# EAGLE board Accumulator Control Unit rev1 (EAGLE 9.6.2)
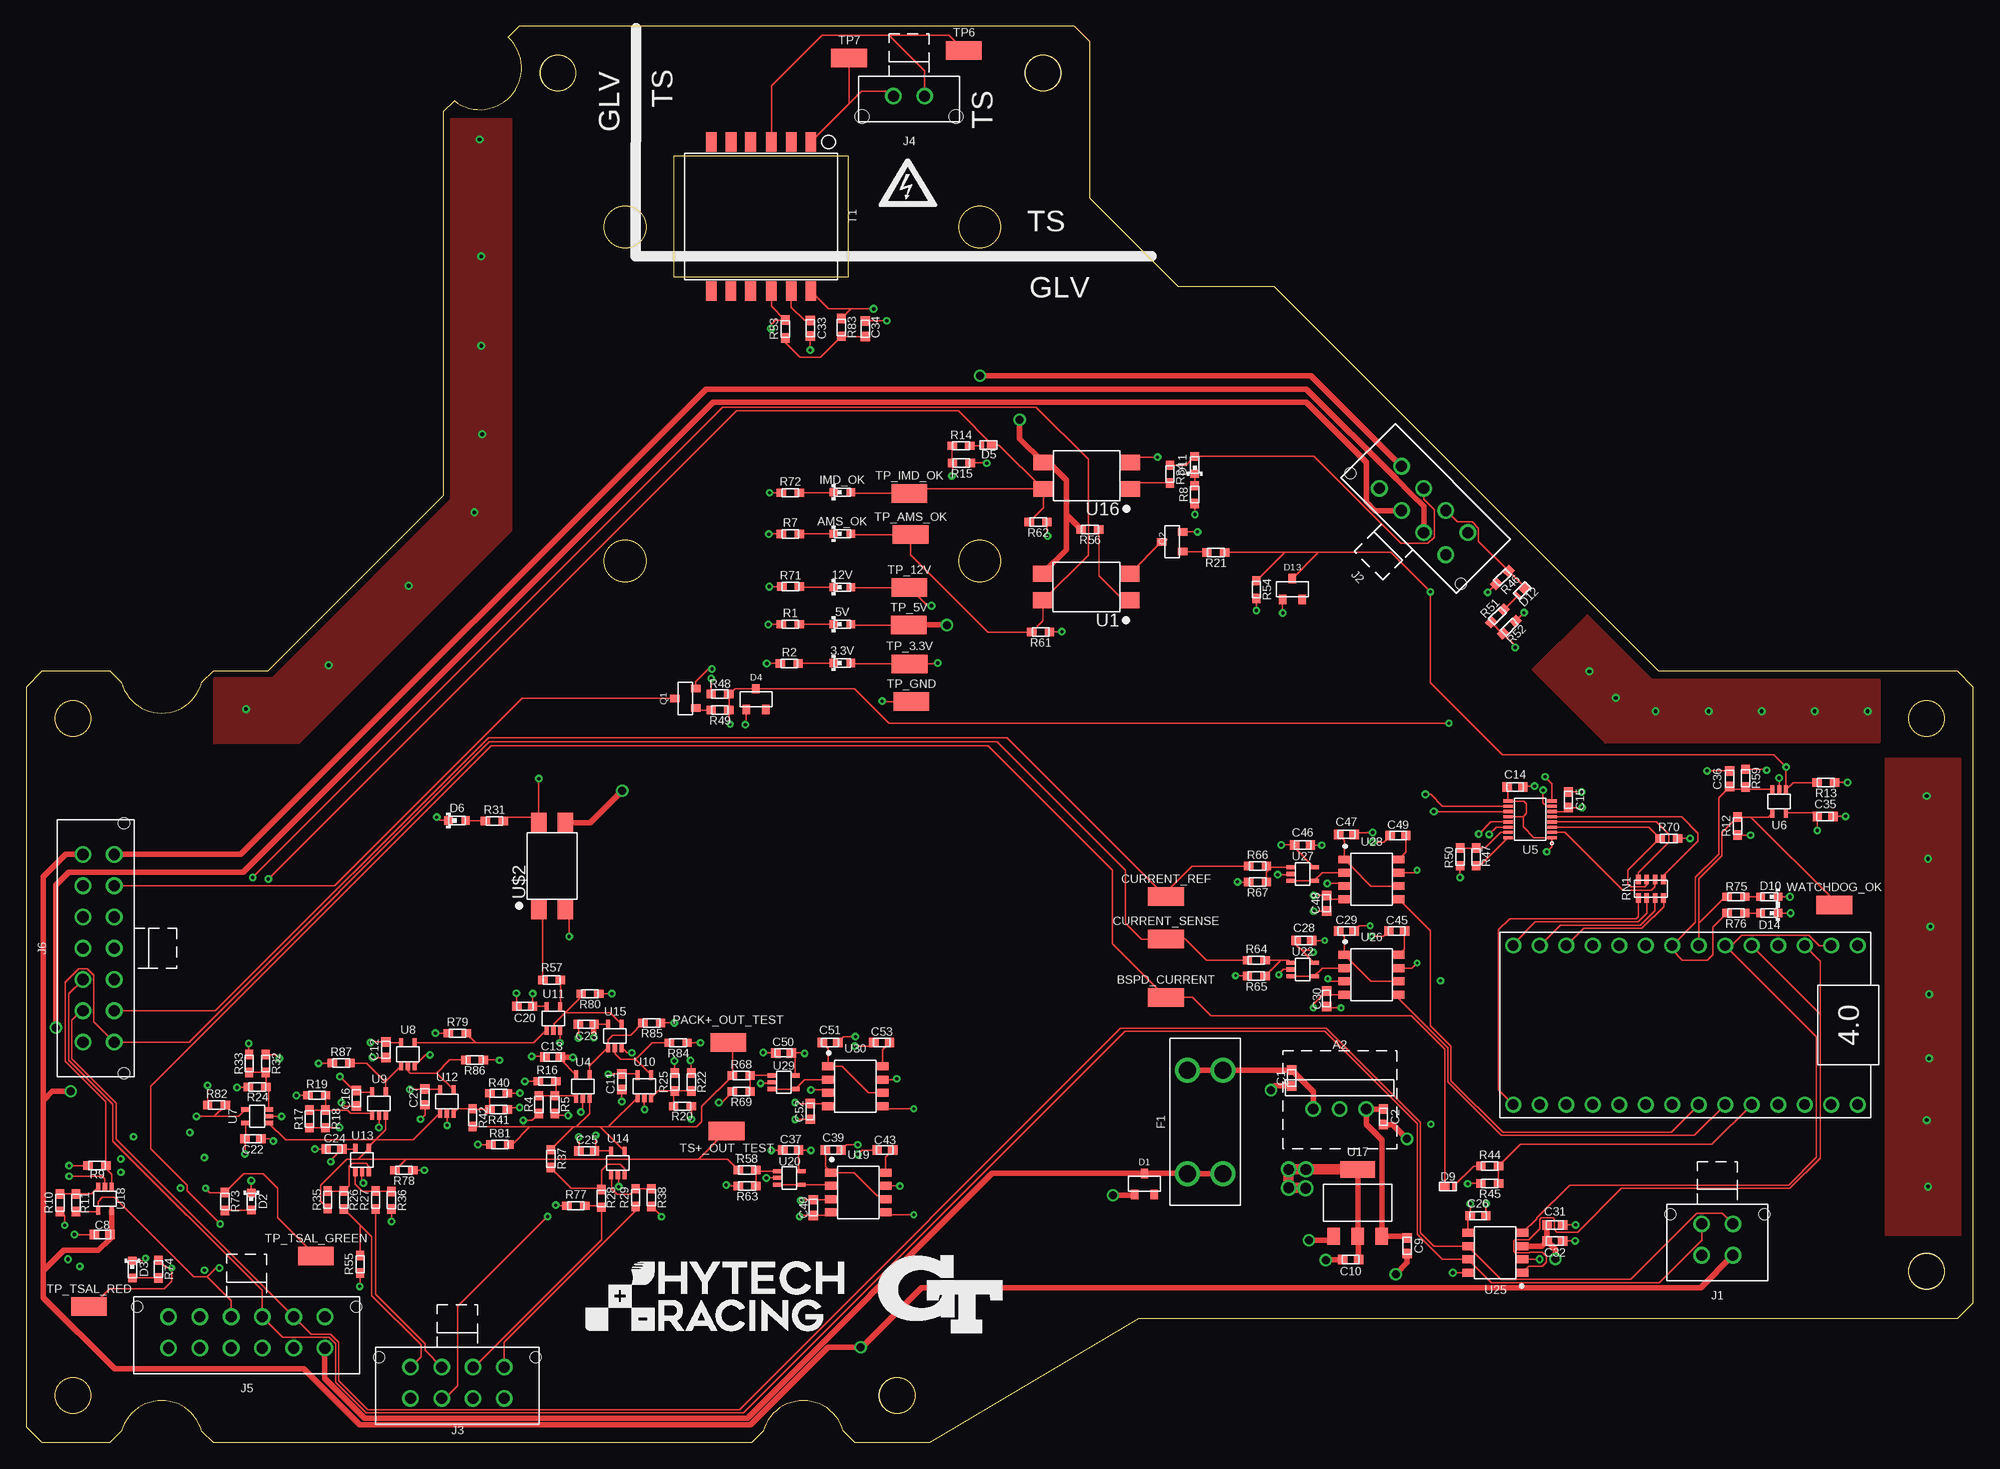
[diagram p5: board, top side]
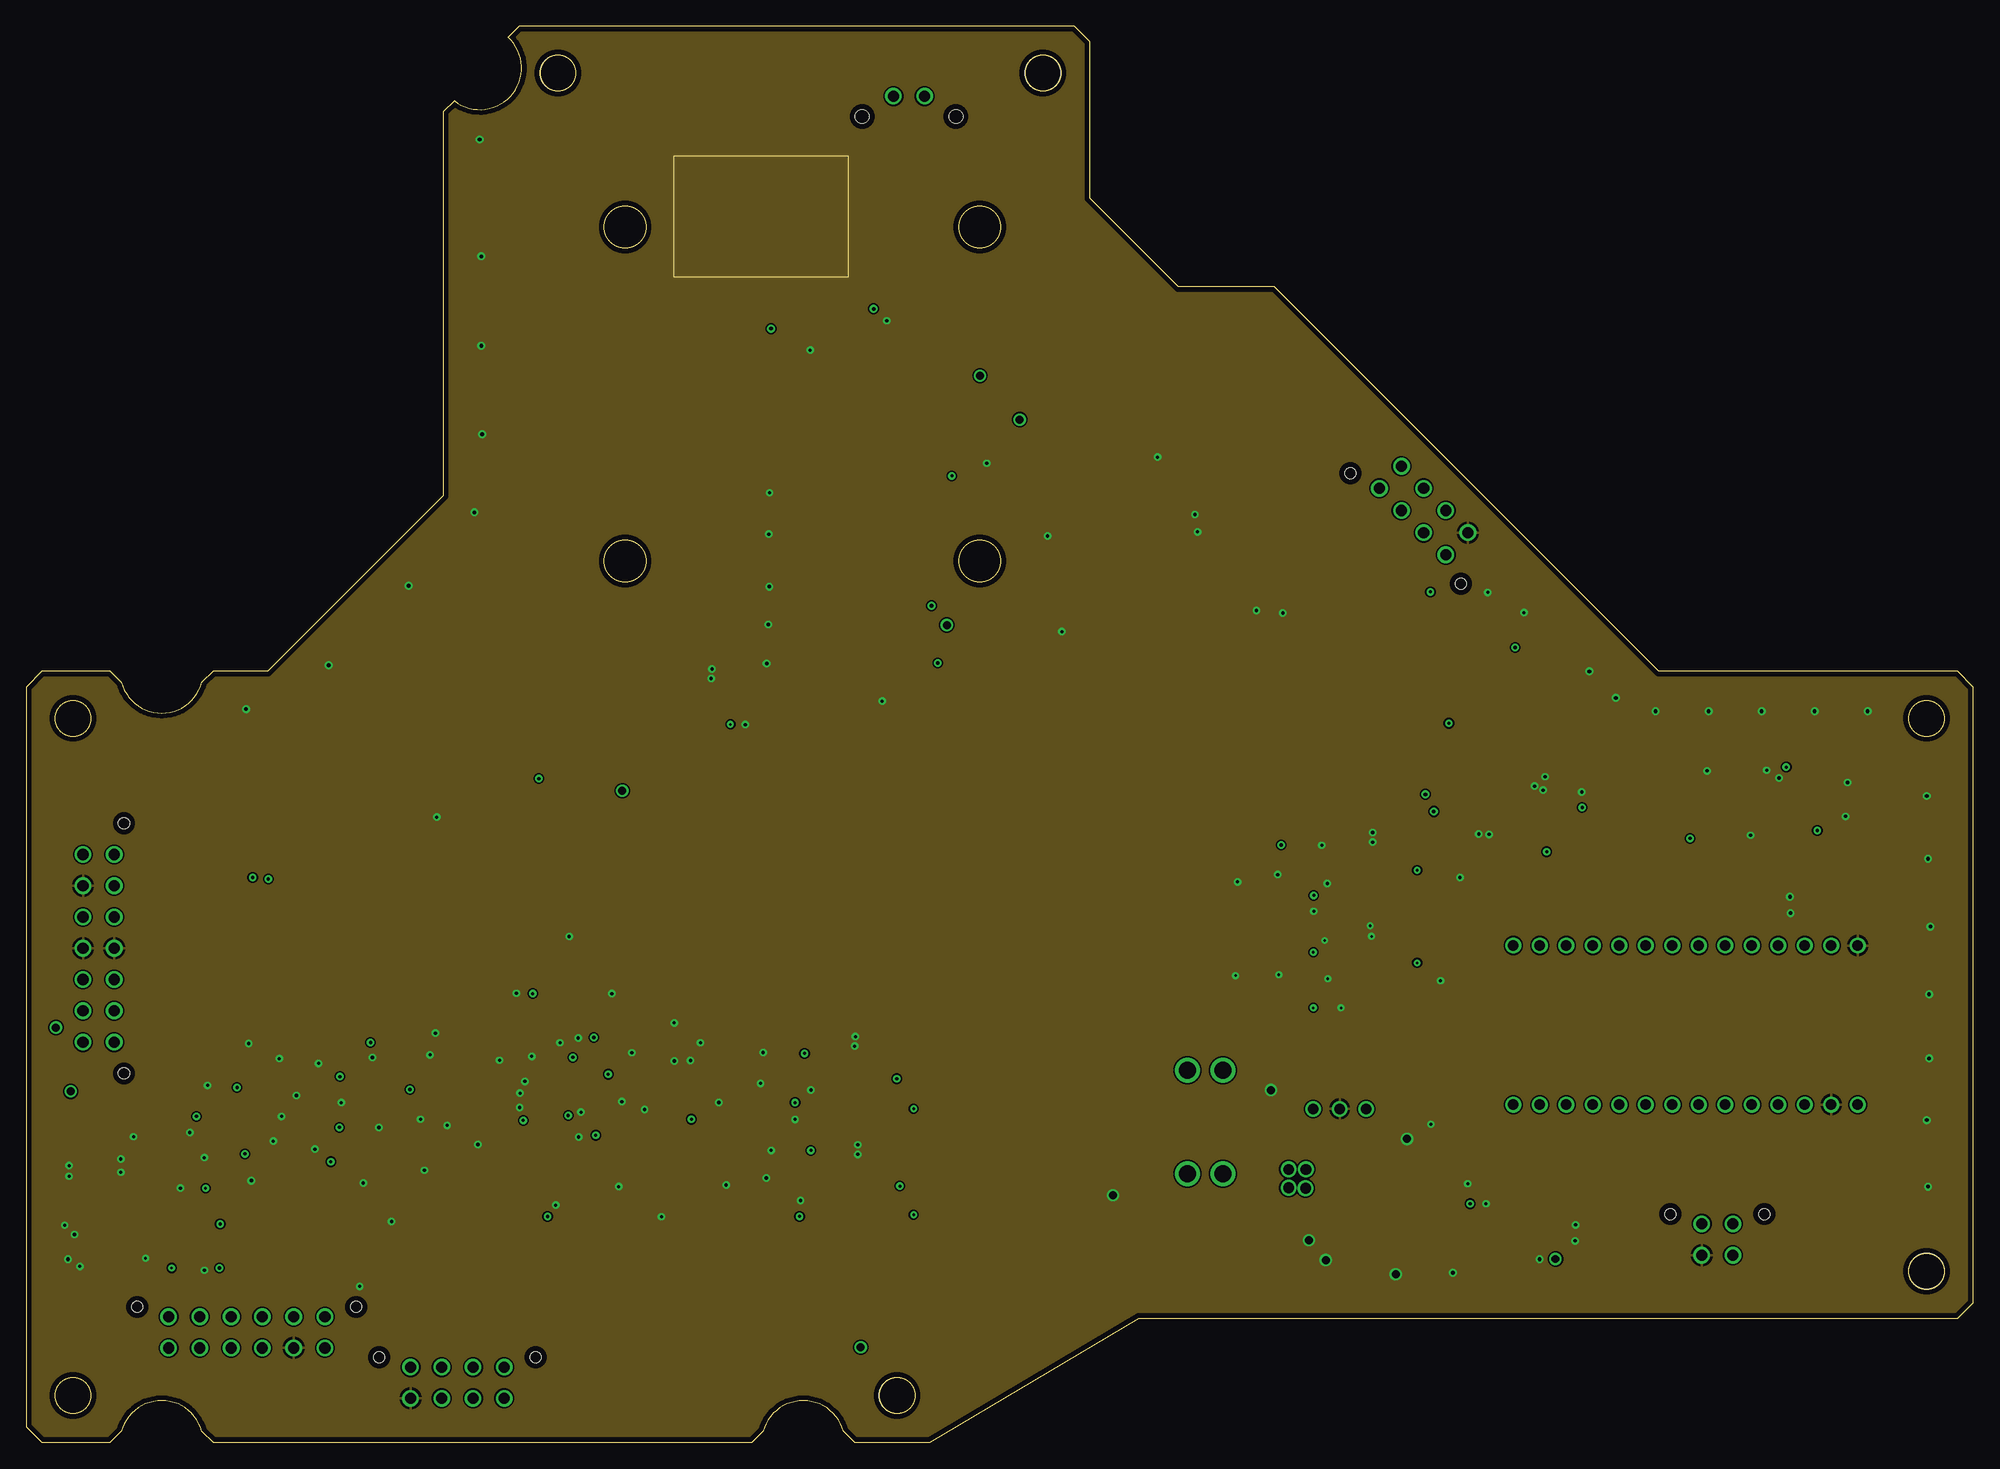
[diagram p6: board, inner layer GND]
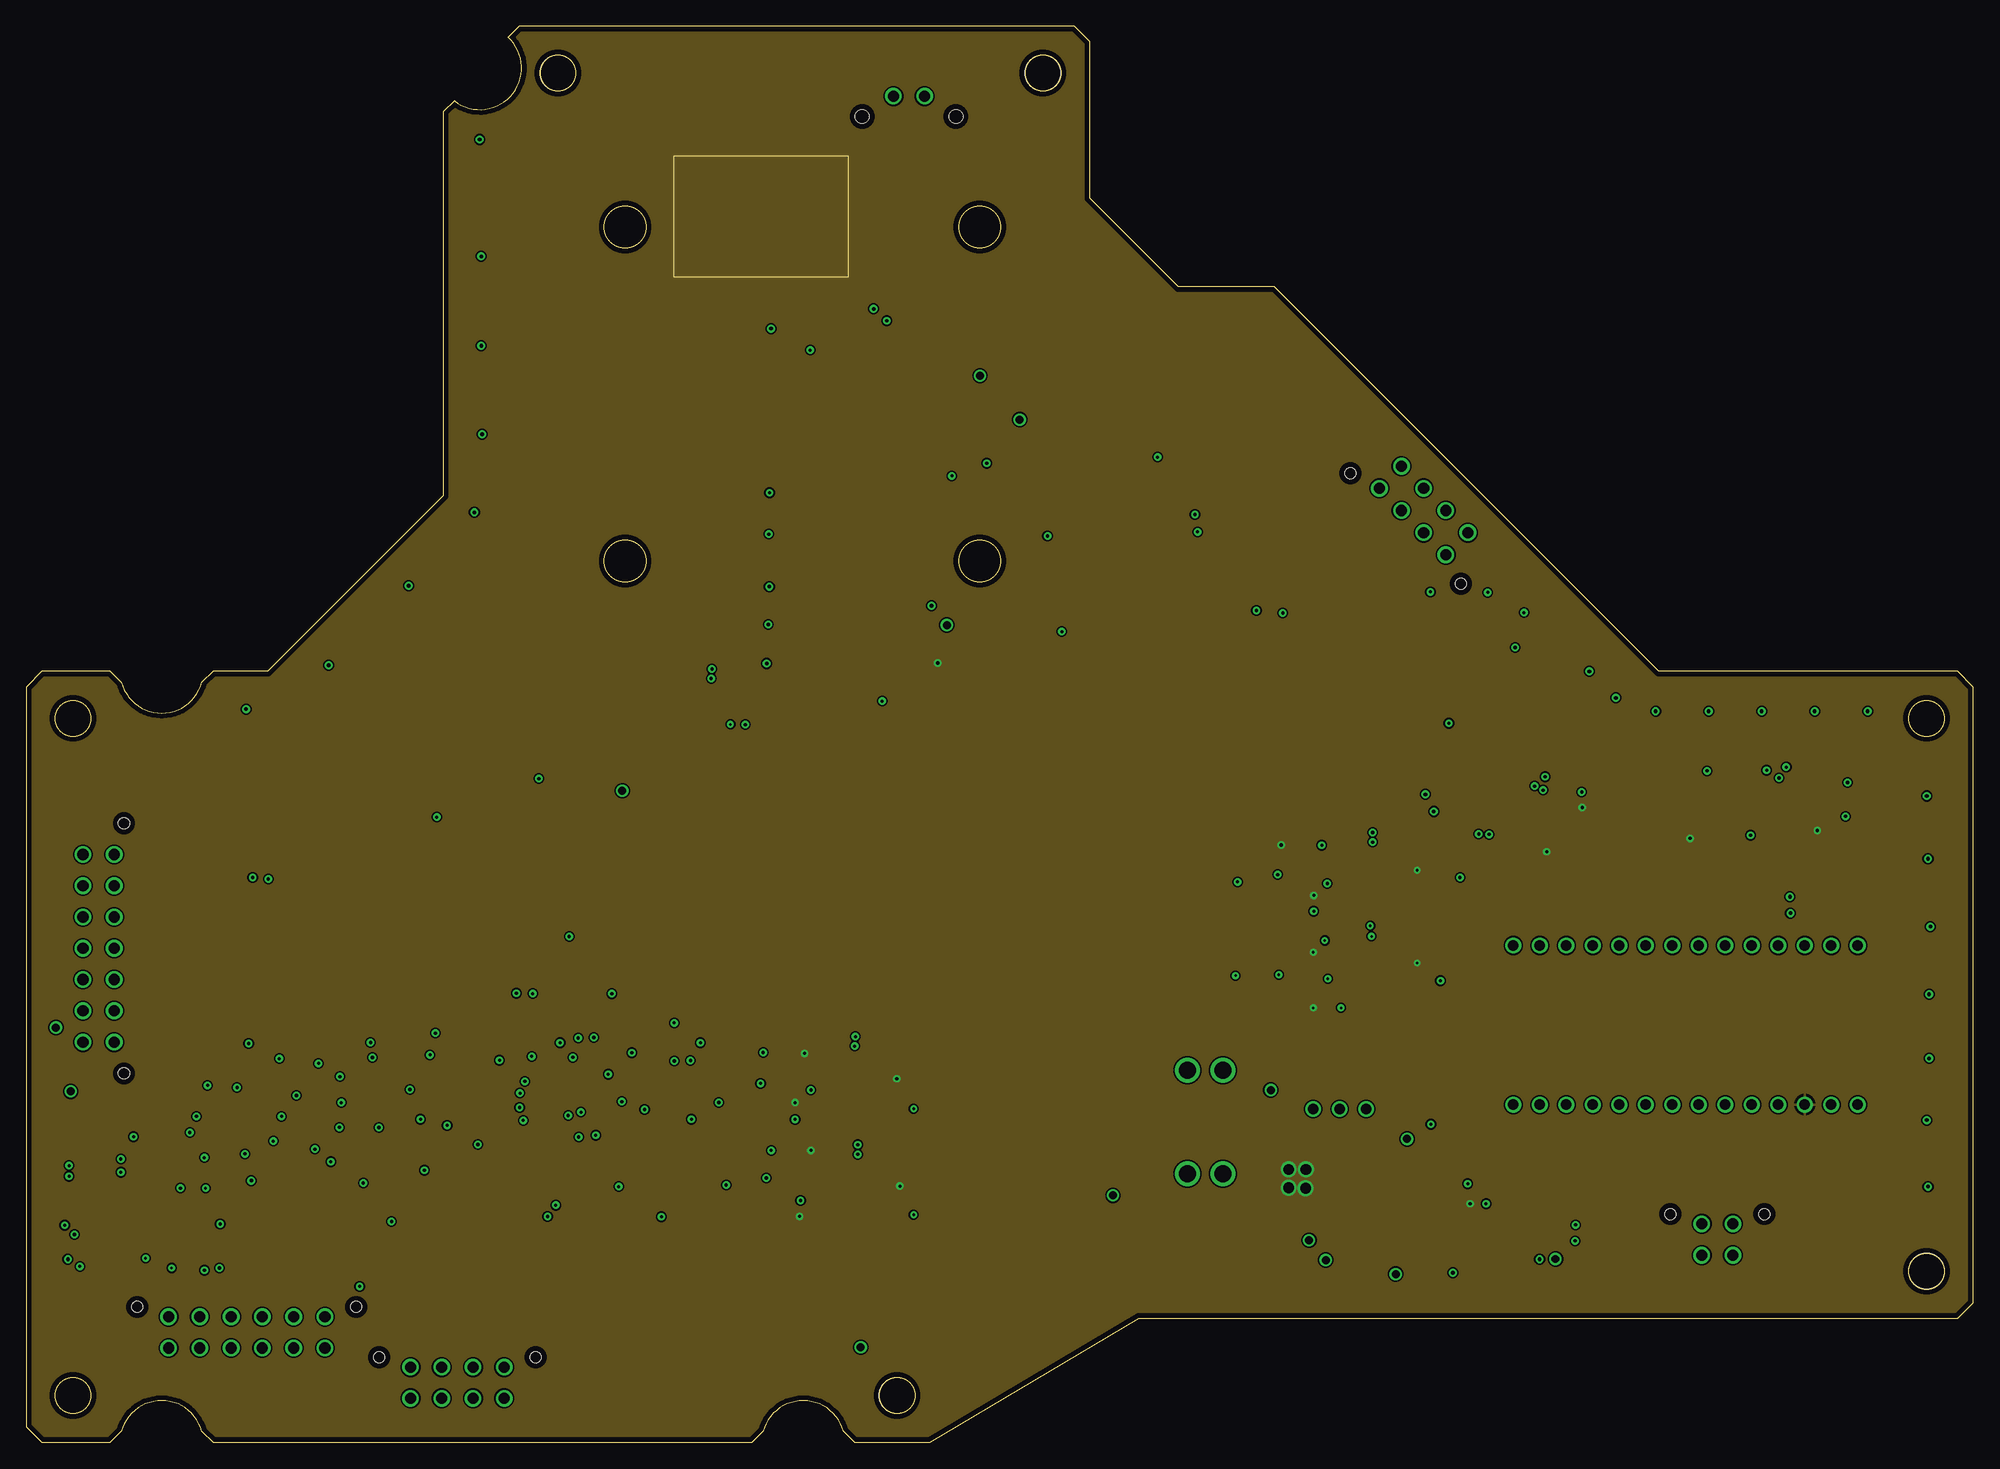
[diagram p7: board, inner layer +3V3]
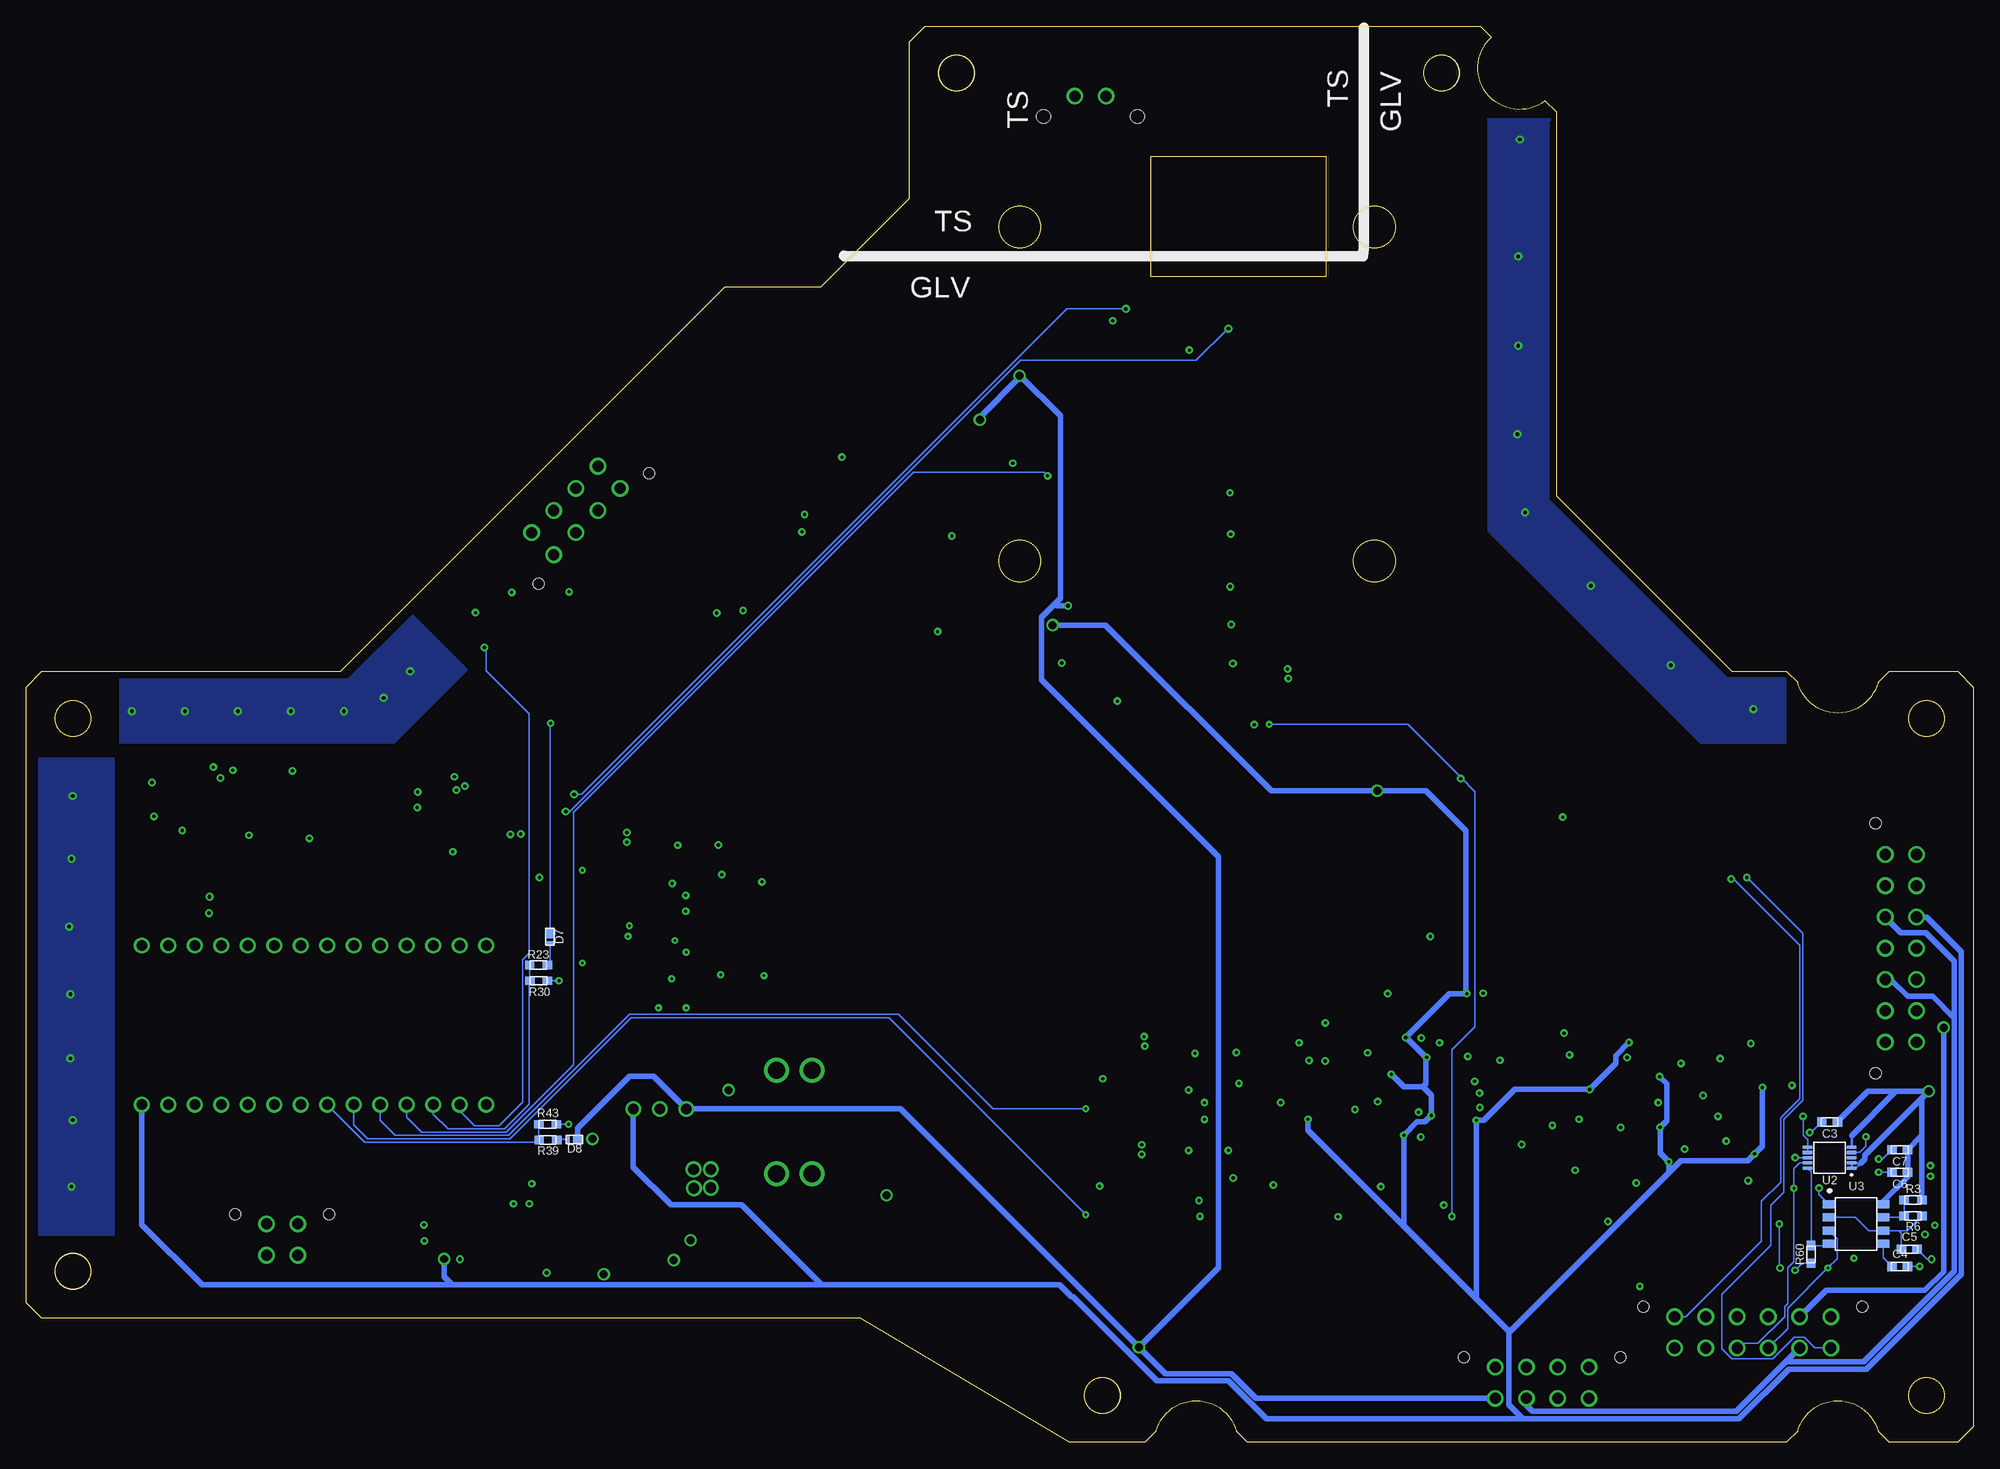
[diagram p8: board, bottom side, seen from below]

Size 186.67 x 135.74 mm. Coordinates in mm from the lower left corner, seen from the top.
Outline: 0,72.39 0,1.5 1.5,0 8.08,0 9.14,1.06 arc-149 16.86,1.06 17.92,0 69.58,0 70.64,1.06 arc-149 78.36,1.06 79.42,0 86.67,0 106.67,11.89 185.17,11.89 186.67,13.39 186.67,72.39 185.17,73.89 156.52,73.89 119.68,110.74 110.49,110.74 102,119.22 102,134.24 100.5,135.74 47.27,135.74 46.21,134.68 arc-175 41.06,128.57 40,127.51 40,90.74 23.15,73.89 17.92,73.89 16.86,72.83 arc-149 9.14,72.83 8.08,73.89 1.5,73.89 0,72.39
Outline: circle at 91.42,116.49 radius 2
Outline: circle at 57.42,116.49 radius 2
Outline: circle at 57.42,84.49 radius 2
Outline: circle at 91.42,84.49 radius 2
Outline: circle at 4.5,69.39 radius 1.7
Outline: circle at 4.5,4.5 radius 1.7
Outline: circle at 83.5,4.5 radius 1.7
Outline: circle at 182.17,16.39 radius 1.7
Outline: circle at 182.17,69.39 radius 1.7
Outline: circle at 51,131.24 radius 1.7
Outline: circle at 97.5,131.24 radius 1.7
Copper layers (1+2*15+16): Top 0.035mm / dielectric 0.2mm / GND 0.0175mm / dielectric 1.065mm / +3V3 0.0175mm / dielectric 0.2mm / Bottom 0.035mm
Design rules "HyTech Default (4 Layer)": minimum track width 6mil, minimum drill 10mil, track to track 6mil, track to pad 6mil, pad to pad 6mil, via to via 20mil, smd to smd 6mil, copper to edge 20mil, drill to drill 21mil, minimum pad ring 8mil, minimum via ring 8mil, stop-mask expansion 3mil, vias tented up to drill 30mil, thermal gap 10mil

## Footprints (pad centres in the part's own frame; a part is rotated, then mirrored left to right if it is on the bottom)
0603-LED = smd 0.8 x 0.8: 1 -0.825,0; 2 0.825,0
TEENSY_SHORT = drill 1.016: 3.3V 0,5.08; AGND/GND 0,2.54; D0 15.24,2.54; D1 15.24,5.08; D2 15.24,7.62; D3 15.24,10.16; D4 15.24,12.7; D5 15.24,15.24; D6 15.24,17.78; D7 15.24,20.32; D8 15.24,22.86; D9 15.24,25.4; D10 15.24,27.94; D11 15.24,30.48; D12 15.24,33.02; D13 0,33.02; D14 0,30.48; D15 0,27.94; D16 0,25.4; D17 0,22.86; D18 0,20.32; D19 0,17.78; D20 0,15.24; D21 0,12.7; D22 0,10.16; D23 0,7.62; GND 15.24,0; VIN 0,0
OKI-78SR = drill 0.991: 1 -2.54,0; 2 0,0; 3 2.54,0
MICRO_MINIATURE = smd 3.429 x 1.778: 1 0,0
0603-CAP = smd 0.9 x 0.9: 1 -0.75,0; 2 0.75,0
SOT-23 = smd 0.711 x 0.889: 1 -0.94,-1.003; 2 0.94,-1.003; 3 0,1.003
CLP1608-2L = smd 0.88 x 0.62: 1 -0.295,0 | smd 0.28 x 0.62: 2 0.595,0
MINI-BLADE_FUSE_HOLDER = drill 1.6: L1 -4.953,1.702; L2 -4.953,-1.702; R1 4.953,1.702; R2 4.953,-1.702
MOLEX_MICROFIT_PTH_VERTICAL_04_DUAL = drill 1.067: 1 1.499,-2.997; 2 -1.499,-2.997; 3 1.499,0; 4 -1.499,0 | hole 1.067: 4.496,0.94; -4.496,0.94
MOLEX_MICROFIT_PTH_VERTICAL_08_DUAL = drill 1.067: 1 4.496,-2.997; 2 1.499,-2.997; 3 -1.499,-2.997; 4 -4.496,-2.997; 5 4.496,0; 6 1.499,0; 7 -1.499,0; 8 -4.496,0 | hole 1.067: 7.493,0.94; -7.493,0.94
MOLEX_MICROFIT_PTH_VERTICAL_02_SINGLE = drill 1.067: 1 1.499,0; 2 -1.499,0 | hole 1.321: 4.496,-1.956; -4.496,-1.956
MOLEX_MICROFIT_PTH_VERTICAL_12_DUAL = drill 1.067: 1 7.493,-2.997; 2 4.496,-2.997; 3 1.499,-2.997; 4 -1.499,-2.997; 5 -4.496,-2.997; 6 -7.493,-2.997; 7 7.493,0; 8 4.496,0; 9 1.499,0; 10 -1.499,0; 11 -4.496,0; 12 -7.493,0 | hole 1.067: 10.49,0.94; -10.49,0.94
MOLEX_MICROFIT_PTH_VERTICAL_14_DUAL = drill 1.067: 1 8.992,-2.997; 2 5.994,-2.997; 3 2.997,-2.997; 4 0,-2.997; 5 -2.997,-2.997; 6 -5.994,-2.997; 7 -8.992,-2.997; 8 8.992,0; 9 5.994,0; 10 2.997,0; 11 0,0; 12 -2.997,0; 13 -5.994,0; 14 -8.992,0 | hole 1.067: 11.989,0.94; -11.989,0.94
0603-RES = smd 0.9 x 0.8: 1 -0.85,0; 2 0.85,0
1206-RES-ARRAY = smd 0.45 x 0.9: 1 -1.2,-0.9; 2 -0.4,-0.9; 3 0.4,-0.9; 4 1.2,-0.9; 5 1.2,0.9; 6 0.4,0.9; 7 -0.4,0.9; 8 -1.2,0.9
HM2112ZNLT_AIRGAP = smd 1.02 x 1.89: 1 -4.78,-7.145; 2 -2.89,-7.145; 3 -1,-7.145; 4 1,-7.145; 5 2.875,-7.145; 6 4.78,-7.145; 7 4.78,7.145; 8 2.89,7.145; 9 1,7.145; 10 -1,7.145; 11 -2.89,7.145; 12 -4.78,7.145
DIP-4 = smd 1.5 x 1.9: 1 -1.27,-4.15; 2 1.27,-4.15; 3 -1.27,4.15; 4 1.27,4.15
MSOP-10 = smd 0.305 x 0.889: 1 -1,-2.106; 2 -0.5,-2.106; 3 0,-2.106; 4 0.5,-2.106; 5 1,-2.106; 6 1,2.106; 7 0.5,2.106; 8 0,2.106; 9 -0.5,2.106; 10 -1,2.106
SOIC-08(NARROW,0.15") = smd 0.762 x 1.143: 1 -1.905,-2.603; 2 -0.635,-2.603; 3 0.635,-2.603; 4 1.905,-2.603; 5 1.905,2.603; 6 0.635,2.603; 7 -0.635,2.603; 8 -1.905,2.603
SC-70-5 = smd 0.4 x 0.9: 1 -0.65,-1.1; 2 0,-1.1; 3 0.65,-1.1; 4 0.65,1.1; 5 -0.65,1.1
MSOP-16 = smd 0.305 x 0.889: 1 -1.75,-2.106; 2 -1.25,-2.106; 3 -0.75,-2.106; 4 -0.25,-2.106; 5 0.25,-2.106; 6 0.75,-2.106; 7 1.25,-2.106; 8 1.75,-2.106; 9 1.75,2.106; 10 1.25,2.106; 11 0.75,2.106; 12 0.25,2.106; 13 -0.25,2.106; 14 -0.75,2.106; 15 -1.25,2.106; 16 -1.75,2.106
SOT223 = smd 1.2 x 1.6: 1 -2.3,-3.2; 2 0,-3.2; 3 2.3,-3.2 | smd 3.3 x 1.6: 4 0,3.2
MOUNTING_M3 = hole 3.4: 0,0

## Placement (x,y rotation side)
3.3V  LED_0603_GREEN  [0603-LED]  78.23,74.69 0 top
5V  LED_0603_BLUE  [0603-LED]  78.23,78.41 0 top
12V  LED_0603_RED  [0603-LED]  78.23,81.96 0 top
A1  TEENSY_4.0  [TEENSY_SHORT]  175.58,32.38 90 top
A2  VOLTAGE_REGULATOR_MODULE_OKI-78SR_5V  [OKI-78SR]  125.93,31.96 0 top
AMS_OK  LED_0603_GREEN  [0603-LED]  78.23,87.08 0 top
BSPD_CURRENT  TEST_POINT  [MICRO_MINIATURE]  109.28,42.64 0 top
C1  CAPACITOR_0603_25V_10UF  [0603-CAP]  121.34,34.93 270 top
C2  CAPACITOR_0603_25V_10UF  [0603-CAP]  130.12,31.2 270 top
C3  CAPACITOR_0603_25V_1UF  [0603-CAP]  13.79,30.72 180 bottom
C4  CAPACITOR_0603_10V_10NF  [0603-CAP]  7.05,16.88 0 bottom
C5  CAPACITOR_0603_10V_4.7UF  [0603-CAP]  6.15,18.52 0 bottom
C6  CAPACITOR_0603_25V_1UF  [0603-CAP]  7.05,25.89 180 bottom
C7  CAPACITOR_0603_25V_0.1UF  [0603-CAP]  7.05,28.05 180 bottom
C8  CAPACITOR_0603_25V_0.1UF  [0603-CAP]  7.31,19.92 180 top
C9  CAPACITOR_0603_10V_1UF  [0603-CAP]  132.38,18.85 270 top
C10  CAPACITOR_0603_10V_4.7UF  [0603-CAP]  126.97,17.53 180 top
C11  CAPACITOR_0603_10V_0.1UF  [0603-CAP]  57.1,34.56 270 top
C12  CAPACITOR_0603_10V_0.1UF  [0603-CAP]  34.5,37.63 270 top
C13  CAPACITOR_0603_10V_0.1UF  [0603-CAP]  50.48,36.92 180 top
C14  CAPACITOR_0603_10V_0.1UF  [0603-CAP]  142.73,62.82 0 top
C15  CAPACITOR_0603_10V_0.1UF  [0603-CAP]  147.84,61.59 270 top
C16  CAPACITOR_0603_10V_0.1UF  [0603-CAP]  31.68,32.99 270 top
C20  CAPACITOR_0603_10V_0.1UF  [0603-CAP]  47.81,41.8 180 top
C22  CAPACITOR_0603_10V_0.1UF  [0603-CAP]  21.75,29.1 0 top
C23  CAPACITOR_0603_10V_0.1UF  [0603-CAP]  53.7,40.07 180 top
C24  CAPACITOR_0603_10V_0.1UF  [0603-CAP]  29.52,28.11 180 top
C25  CAPACITOR_0603_10V_0.1UF  [0603-CAP]  53.75,27.93 180 top
C26  CAPACITOR_0603_10V_0.1UF  [0603-CAP]  139.19,21.73 180 top
C27  CAPACITOR_0603_10V_0.1UF  [0603-CAP]  38.23,33.11 270 top
C28  CAPACITOR_0603_25V_0.1UF  [0603-CAP]  122.5,48.12 0 top
C29  CAPACITOR_0603_10V_0.1UF  [0603-CAP]  126.56,49.01 0 top
C30  CAPACITOR_0603_10V_0.1UF  [0603-CAP]  124.66,42.53 270 top
C31  CAPACITOR_0603_10V_0.1UF  [0603-CAP]  146.55,20.84 180 top
C32  CAPACITOR_0603_10V_1UF  [0603-CAP]  146.55,19.31 180 top
C33  CAPACITOR_0603_10V_10NF  [0603-CAP]  75.16,106.77 270 top
C34  CAPACITOR_0603_10V_15PF  [0603-CAP]  80.44,106.73 90 top
C35  CAPACITOR_0603_10V_0.1UF  [0603-CAP]  172.46,59.98 0 top
C36  CAPACITOR_0603_10V_0.1UF  [0603-CAP]  163.31,63.6 90 top
C37  CAPACITOR_0603_25V_0.1UF  [0603-CAP]  73.3,28.02 180 top
C39  CAPACITOR_0603_10V_0.1UF  [0603-CAP]  77.37,28.02 0 top
C40  CAPACITOR_0603_10V_0.1UF  [0603-CAP]  75.46,22.51 90 top
C43  CAPACITOR_0603_10V_680PF  [0603-CAP]  82.32,28.02 180 top
C45  CAPACITOR_0603_10V_680PF  [0603-CAP]  131.39,49.01 180 top
C46  CAPACITOR_0603_25V_0.1UF  [0603-CAP]  122.37,57.26 0 top
C47  CAPACITOR_0603_10V_0.1UF  [0603-CAP]  126.56,58.28 0 top
C48  CAPACITOR_0603_10V_0.1UF  [0603-CAP]  124.66,51.67 270 top
C49  CAPACITOR_0603_10V_680PF  [0603-CAP]  131.51,58.15 180 top
C50  CAPACITOR_0603_25V_0.1UF  [0603-CAP]  72.62,37.34 180 top
C51  CAPACITOR_0603_10V_0.1UF  [0603-CAP]  77.06,38.33 0 top
C52  CAPACITOR_0603_10V_0.1UF  [0603-CAP]  75.16,31.73 270 top
C53  CAPACITOR_0603_10V_680PF  [0603-CAP]  82.02,38.33 180 top
CURRENT_REF  TEST_POINT  [MICRO_MINIATURE]  109.28,52.3 0 top
CURRENT_SENSE  TEST_POINT  [MICRO_MINIATURE]  109.28,48.27 0 top
D1  TVS_15V  [SOT-23]  107.21,24.78 0 top
D2  LED_0603_GREEN  [0603-LED]  21.59,23.09 270 top
D3  LED_0603_RED  [0603-LED]  10.18,16.59 270 top
D4  TVS_8V  [SOT-23]  69.97,71.23 0 top
D5  SCHOTTKY  [CLP1608-2L]  92.26,95.57 180 top
D6  LED_0603_RED  [0603-LED]  41.31,59.61 0 top
D7  SCHOTTKY  [CLP1608-2L]  136.46,48.47 270 bottom
D8  SCHOTTKY  [CLP1608-2L]  134.11,29.04 180 bottom
D9  SCHOTTKY  [CLP1608-2L]  136.29,24.52 0 top
D10  LED_0603_GREEN  [0603-LED]  167.11,52.3 180 top
D11  LED_0603_YELLOW  [0603-LED]  112.04,93.66 90 top
D12  SCHOTTKY  [CLP1608-2L]  143.41,81.65 225 top
D13  TVS_8V  [SOT-23]  121.39,81.78 0 top
D14  LED_0603_RED  [0603-LED]  167.11,50.72 180 top
F1  FUSE_MINI-BLADE_1A  [MINI-BLADE_FUSE_HOLDER]  113.03,30.71 90 top
IMD_OK  LED_0603_ORANGE  [0603-LED]  78.23,91.06 0 top
J1  CONNECTOR-CAN_MF_T_V_  [MOLEX_MICROFIT_PTH_VERTICAL_04_DUAL]  162.12,20.94 0 top
J2  CONNECTOR-8_MF_T_V_  [MOLEX_MICROFIT_PTH_VERTICAL_08_DUAL]  132.91,88.25 135 top
J3  CONNECTOR-8_MF_T_V_  [MOLEX_MICROFIT_PTH_VERTICAL_08_DUAL]  41.34,7.21 0 top
J4  CONNECTOR-2_MF_T_V_  [MOLEX_MICROFIT_PTH_VERTICAL_02_SINGLE]  84.64,129.02 0 top
J5  CONNECTOR-12_MF_T_V_  [MOLEX_MICROFIT_PTH_VERTICAL_12_DUAL]  21.15,12.05 0 top
J6  CONNECTOR-14_MF_T_V_  [MOLEX_MICROFIT_PTH_VERTICAL_14_DUAL]  8.45,47.36 270 top
PACK+_OUT_TEST  TEST_POINT  [MICRO_MINIATURE]  67.31,38.33 180 top
Q1  TRANSISTOR_N_MOS__PMV15ENEA  [SOT-23]  63.19,71.31 90 top
Q2  TRANSISTOR_N_MOS__PMV15ENEA  [SOT-23]  109.86,86.31 90 top
R1  RESISTOR_0603_1K  [0603-RES]  73.25,78.41 0 top
R2  RESISTOR_0603_1K  [0603-RES]  73.15,74.65 0 top
R3  RESISTOR_0603_1K  [0603-RES]  5.78,23.23 0 bottom
R4  RESISTOR_0603_DNP  [0603-RES]  49.15,32.38 270 top
R5  RESISTOR_0603_4.12K  [0603-RES]  50.68,32.38 270 top
R6  RESISTOR_0603_43K  [0603-RES]  5.78,21.7 180 bottom
R7  RESISTOR_0603_1K  [0603-RES]  73.25,87.07 0 top
R8  RESISTOR_0603_1K  [0603-RES]  112.04,90.83 90 top
R9  RESISTOR_0603_10K  [0603-RES]  6.8,26.53 0 top
R10  RESISTOR_0603_1K  [0603-RES]  3.24,22.97 90 top
R11  RESISTOR_0603_1.4K  [0603-RES]  4.77,22.97 270 top
R12  RESISTOR_0603_10K  [0603-RES]  164.05,59.08 90 top
R13  RESISTOR_0603_100K  [0603-RES]  172.52,63.24 180 top
R14  RESISTOR_0603_43K  [0603-RES]  89.62,95.51 180 top
R15  RESISTOR_0603_12K  [0603-RES]  89.65,93.88 0 top
R16  RESISTOR_0603_10.2K  [0603-RES]  49.94,34.61 0 top
R17  RESISTOR_0603_4.12K  [0603-RES]  27.16,31 270 top
R18  RESISTOR_0603_DNP  [0603-RES]  28.71,31 270 top
R19  RESISTOR_0603_10.2K  [0603-RES]  27.87,33.27 0 top
R20  RESISTOR_0603_11.5K  [0603-RES]  62.92,32.22 0 top
R21  RESISTOR_0603_10  [0603-RES]  114.05,85.3 180 top
R22  RESISTOR_0603_DNP  [0603-RES]  63.76,34.54 270 top
R23  RESISTOR_0603_10K  [0603-RES]  137.56,45.76 180 bottom
R24  RESISTOR_0603_84.5K  [0603-RES]  22.15,34.05 180 top
R25  RESISTOR_0603_11.5K  [0603-RES]  62.18,34.54 270 top
R26  RESISTOR_0603_11.5K  [0603-RES]  30.46,23.23 90 top
R27  RESISTOR_0603_11.5K  [0603-RES]  33.51,23.23 90 top
R28  RESISTOR_0603_11.5K  [0603-RES]  55.15,23.38 90 top
R29  RESISTOR_0603_11.5K  [0603-RES]  58.43,23.46 90 top
R30  RESISTOR_0603_12K  [0603-RES]  137.54,44.24 0 bottom
R31  RESISTOR_0603_1K  [0603-RES]  44.89,59.55 0 top
R32  RESISTOR_0603_DNP  [0603-RES]  22.97,36.31 270 top
R33  RESISTOR_0603_11.5K  [0603-RES]  21.39,36.31 270 top
R34  RESISTOR_0603_2K  [0603-RES]  109.65,92.8 270 top
R35  RESISTOR_0603_10.5K  [0603-RES]  28.91,23.26 270 top
R36  RESISTOR_0603_10.5K  [0603-RES]  35.03,23.21 270 top
R37  RESISTOR_0603_10.5K  [0603-RES]  50.3,27.19 90 top
R38  RESISTOR_0603_10.5K  [0603-RES]  59.95,23.46 270 top
R39  RESISTOR_0603_43K  [0603-RES]  136.65,28.97 180 bottom
R40  RESISTOR_0603_DNP  [0603-RES]  45.29,33.47 180 top
R41  RESISTOR_0603_215K  [0603-RES]  45.29,31.92 180 top
R42  RESISTOR_0603_11.3K  [0603-RES]  42.8,31.13 270 top
R43  RESISTOR_0603_12K  [0603-RES]  136.67,30.49 0 bottom
R44  RESISTOR_0603_43K  [0603-RES]  140.3,26.48 0 top
R45  RESISTOR_0603_12K  [0603-RES]  140.3,24.83 180 top
R46  RESISTOR_0603_2.2K  [0603-RES]  141.53,82.89 45 top
R47  RESISTOR_0603_1K  [0603-RES]  139.02,56.12 90 top
R48  RESISTOR_0603_10K  [0603-RES]  66.52,71.74 180 top
R49  RESISTOR_0603_10  [0603-RES]  66.52,70.19 180 top
R50  RESISTOR_0603_1K  [0603-RES]  137.47,56.11 270 top
R51  RESISTOR_0603_30K  [0603-RES]  141.04,79.21 225 top
R52  RESISTOR_0603_12K  [0603-RES]  142.17,78.12 45 top
R53  RESISTOR_0603_60.4  [0603-RES]  72.77,106.71 90 top
R54  RESISTOR_0603_10K  [0603-RES]  117.95,81.73 270 top
R55  RESISTOR_0603_10K  [0603-RES]  32.03,17.07 90 top
R56  RESISTOR_0603_2K  [0603-RES]  101.99,87.51 180 top
R57  RESISTOR_0603_470  [0603-RES]  50.37,44.31 180 top
R58  RESISTOR_0603_10K  [0603-RES]  69.11,26.11 0 top
R59  RESISTOR_0603_1K  [0603-RES]  164.83,63.66 270 top
R60  RESISTOR_0603_10K  [0603-RES]  15.56,18.02 90 bottom
R61  RESISTOR_0603_10K  [0603-RES]  97.26,77.66 180 top
R62  RESISTOR_0603_10K  [0603-RES]  97.01,88.2 180 top
R63  RESISTOR_0603_12K  [0603-RES]  69.11,24.59 180 top
R64  RESISTOR_0603_10K  [0603-RES]  117.93,46.21 0 top
R65  RESISTOR_0603_12K  [0603-RES]  117.93,44.69 180 top
R66  RESISTOR_0603_10K  [0603-RES]  118.05,55.23 0 top
R67  RESISTOR_0603_12K  [0603-RES]  118.05,53.71 180 top
R68  RESISTOR_0603_10K  [0603-RES]  68.55,35.15 0 top
R69  RESISTOR_0603_12K  [0603-RES]  68.55,33.63 180 top
R70  RESISTOR_0603_1K  [0603-RES]  157.48,57.89 0 top
R71  RESISTOR_0603_1K  [0603-RES]  73.28,82.02 0 top
R72  RESISTOR_0603_2K  [0603-RES]  73.25,91.01 0 top
R73  RESISTOR_0603_2K  [0603-RES]  19.05,23.09 270 top
R74  RESISTOR_0603_2K  [0603-RES]  12.7,16.61 270 top
R75  RESISTOR_0603_470  [0603-RES]  163.91,52.3 180 top
R76  RESISTOR_0603_470  [0603-RES]  163.91,50.72 180 top
R77  RESISTOR_0603_10K  [0603-RES]  52.7,22.68 0 top
R78  RESISTOR_0603_10K  [0603-RES]  36.22,26.09 180 top
R79  RESISTOR_0603_10K  [0603-RES]  41.35,39.22 0 top
R80  RESISTOR_0603_10K  [0603-RES]  54.05,43 180 top
R81  RESISTOR_0603_10K  [0603-RES]  45.41,28.55 0 top
R82  RESISTOR_0603_10K  [0603-RES]  18.26,32.34 0 top
R83  RESISTOR_0603_60.4  [0603-RES]  78.16,106.86 270 top
R84  RESISTOR_0603_10K  [0603-RES]  62.51,38.3 180 top
R85  RESISTOR_0603_10K  [0603-RES]  59.97,40.21 180 top
R86  RESISTOR_0603_10K  [0603-RES]  43,36.65 180 top
R87  RESISTOR_0603_10K  [0603-RES]  30.2,36.35 0 top
RN1  RESISTOR_NETWORK_4_100  [1206-RES-ARRAY]  155.75,53.06 0 top
T1  TRANSFORMER_HM2112ZNLT_AIRGAP  [HM2112ZNLT_AIRGAP]  70.45,117.49 180 top
TP6  TEST_POINT  [MICRO_MINIATURE]  89.89,133.42 0 top
TP7  TEST_POINT  [MICRO_MINIATURE]  78.9,132.68 0 top
TP_3.3V  TEST_POINT  [MICRO_MINIATURE]  84.68,74.62 0 top
TP_5V  TEST_POINT  [MICRO_MINIATURE]  84.62,78.32 0 top
TP_12V  TEST_POINT  [MICRO_MINIATURE]  84.66,81.93 0 top
TP_AMS_OK  TEST_POINT  [MICRO_MINIATURE]  84.78,87 0 top
TP_GND  TEST_POINT  [MICRO_MINIATURE]  84.85,71 0 top
TP_IMD_OK  TEST_POINT  [MICRO_MINIATURE]  84.66,90.96 0 top
TP_TSAL_GREEN  TEST_POINT  [MICRO_MINIATURE]  27.79,17.86 0 top
TP_TSAL_RED  TEST_POINT  [MICRO_MINIATURE]  6.02,13.01 0 top
TS+_OUT_TEST  TEST_POINT  [MICRO_MINIATURE]  67.16,29.85 180 top
U1  RELAY_SOLIDSTATE_NO  [DIP-4]  101.64,81.98 90 top
U2  ADG1423  [MSOP-10]  13.79,27.29 90 bottom
U3  LM555  [SOIC-08(NARROW,0.15")]  11.25,20.94 270 bottom
U4  OPAMP_1_CHANNEL_OPA991  [SC-70-5]  53.37,34.1 0 top
U5  LTC6820  [MSOP-16]  144.17,59.71 90 top
U6  ADM823  [SC-70-5]  168.05,61.43 180 top
U7  OPAMP_1_CHANNEL_OPA991  [SC-70-5]  22.15,31.26 90 top
U8  LOGICGATE_AND_DCK3  [SC-70-5]  36.61,37.2 0 top
U9  OPAMP_1_CHANNEL_OPA991  [SC-70-5]  33.84,32.48 0 top
U10  OPAMP_1_CHANNEL_OPA991  [SC-70-5]  59.26,34.13 0 top
U11  LOGICGATE_AND_DCK3  [SC-70-5]  50.55,40.63 0 top
U12  OPAMP_1_CHANNEL_OPA991  [SC-70-5]  40.34,32.68 0 top
U13  OPAMP_1_CHANNEL_OPA991  [SC-70-5]  32.21,27.07 0 top
U14  OPAMP_1_CHANNEL_OPA991  [SC-70-5]  56.72,26.79 0 top
U15  LOGICGATE_AND_DCK3  [SC-70-5]  56.44,38.96 0 top
U16  RELAY_SOLIDSTATE_NO  [DIP-4]  101.67,92.64 90 top
U17  VOLTAGE_REGULATOR_SOT223_3.3V  [SOT223]  127.66,22.96 0 top
U18  OPAMP_1_CHANNEL_OPA991  [SC-70-5]  7.56,23.35 180 top
U19  MAX7404  [SOIC-08(NARROW,0.15")]  79.78,23.95 270 top
U20  OPAMP_1_CHANNEL_OPA991  [SC-70-5]  73.18,25.35 270 top
U22  OPAMP_1_CHANNEL_OPA991  [SC-70-5]  122.37,45.32 270 top
U25  TCAN1051HQV-Q1  [SOIC-08(NARROW,0.15")]  140.84,18.17 90 top
U26  MAX7404  [SOIC-08(NARROW,0.15")]  128.97,44.82 270 top
U27  OPAMP_1_CHANNEL_OPA991  [SC-70-5]  122.37,54.47 270 top
U28  MAX7404  [SOIC-08(NARROW,0.15")]  128.97,53.96 270 top
U29  OPAMP_1_CHANNEL_OPA991  [SC-70-5]  72.62,34.52 270 top
U30  MAX7404  [SOIC-08(NARROW,0.15")]  79.48,34.14 270 top
U$1  [GLV]  99.06,110.72 0 top
U$2  RELAY_SOLIDSTATE_NO  [DIP-4]  50.42,55.24 0 top
U$3  [TS]  91.64,127.74 90 top
U$4  [HV_0.50"]  84.53,120.73 0 top
U$5  [GLV]  55.88,128.5 90 top
U$6  [MOUNTING_M3]  4.5,69.39 0 top
U$7  [MOUNTING_M3]  4.5,4.5 0 top
U$8  [MOUNTING_M3]  83.49,4.5 0 top
U$9  [TS]  60.96,129.77 90 top
U$10  [TS]  97.79,117.07 180 top
U$11  [MOUNTING_M3]  182.17,16.41 0 top
U$12  [MOUNTING_M3]  182.17,69.39 0 top
U$13  [MOUNTING_M3]  97.46,131.24 0 top
U$14  [MOUNTING_M3]  50.98,131.24 0 top
U$15  [LOGO_HYTECH_1.0"]  53.34,10.39 0 top
U$16  [LOGO_GT_0.50"]  87.63,14.2 0 top
WATCHDOG_OK  TEST_POINT  [MICRO_MINIATURE]  173.33,51.51 0 top

## Tracks (layer width: path | path; a pad name or v marks a point on that pad's centre or on a via)
0.95X_DIV
  Top 0.152: R40.2 R41.2 42.87,31.92 R42.1 41.39,31.98 U12.3
0.5989V_DIV
  Top 0.152: U7.3 23.25,33.8 R24.1 23,35.43 R32.2 R33.2
2.5_DIV
  Top 0.152: R22.2 R25.2 | U10.3 60.57,33.69 R25.2 | R20.1 62.07,33.57 R25.2
3.56V_DIV_A
  Top 0.152: R18.1 28.71,33.25 R19.2 | R17.1 R18.1 | R18.1 30.84,31.85 31.13,31.56 33.01,31.56 U9.1
3.56V_DIV_B
  Top 0.152: R5.1 R4.1 | R16.2 50.79,33.34 R5.1 | R5.1 52.5,33.23 U4.1
12V_SCALED_3.3V
  Bottom 0.152: R43.1 137.52,28.99 R39.2 137.68,28.78 154.2,28.78 A1.D19
12VIN
  Top 0.508: J5.1 28.64,6.13 32.44,2.34 69.17,2.34 92.61,25.78 D1.3 111.31,25.78 F1.L1 F1.L2
60V_THRESHOLD  (via drill 0.3)
  Top 0.152: v16.33,31.25 17.78,31.25 18.03,31.25 | 18.03,31.25 20.4,31.25 U7.4 | R82.2 18.03,31.25
  Bottom 0.152: U2.7 U2.6 15.89,29.01 16.33,29.44 v16.33,31.25
+3V3  (via drill 0.25, 0.3, 1.02)
  Top 0.152: U26.4 125.03,42.91 C30.1 123.39,42.01 v123.39,41.64 | U22.5 122.29,47.15 | 122.29,47.15 121.75,47.7 C28.1 | 122.29,47.15 123.21,47.15 v123.39,46.98 | U25.5 138.23,21.52 C26.2 138.44,22.86 v138.42,22.87 | U20.5 74.05,26.22 C37.1 75.21,28.02 v75.23,27.99 | U19.4 76.88,21.76 C40.1 74.23,21.76 v74.14,21.67 | U19.7 83.74,24.59 v83.77,24.56 | U29.5 73.72,36.99 C50.1 74.57,37.34 v74.62,37.29 | U30.4 76.63,32.48 C52.1 73.8,32.48 v73.71,32.56 | U30.7 83.39,34.77 v83.46,34.85 | U28.4 125.03,52.06 C48.1 v123.45,52.42 v123.44,52.43 | U27.5 121.62,56.97 C46.1 120.33,57.26 v120.32,57.25 | U6.5 171.36,60.33 C35.1 v171.71,58.66 v171.7,58.65 | U5.6 147.46,60.46 C15.2 v149.16,60.84 v149.17,60.85 | v87.4,74.7 87.32,74.62 TP_3.3V.1 79.13,74.62 3.3V.2 | U28.7 133.11,54.6 v133.35,54.84 | U26.7 132.85,45.45 v133.35,45.95 | C14.1 142.06,62.73 U5.9 143.57,61.46 143.84,61.19 143.84,60.28 143.53,59.96 | v145.78,56.61 146.27,57.11 U5.1 144.55,57.96 143.53,58.99 143.53,59.96 | 143.53,59.96 U5.12 | R70.2 v159.51,57.89
  Top 0.508: C10.1 127.72,19.7 U17.2 U17.4
  Top 1.016: U17.4 v122.68,26.16 | v122.68,26.16 | v122.68,26.16 v121.03,26.16 v121.03,24.41 122.61,24.41 v122.66,24.36
  pour +3V3: -24.13,151.36 -24.13,-6.12 196.85,-6.12 196.85,151.36
+5V  (via drill 0.3, 0.76)
  Top 0.152: U4.5 51.23,36.7 C13.1 | R4.2 48.49,30.87 v47.66,30.87 | R5.2 50.87,31.34 v51.97,31.34 | U10.5 58.53,35.31 C11.1 55.83,35.31 v55.81,35.29 | R20.2 63.77,30.98 v63.79,30.97 | U7.5 21.05,29.16 C22.1 21,27.68 v20.97,27.66 | v20.23,34.02 20.26,34.05 R24.2 | v30.09,35.06 31.41,33.74 C16.1 31.84,33.58 U9.5 | v36.79,33.83 36.82,33.86 C27.1 39.61,33.86 U12.5 | U8.5 34.58,38.3 C12.1 33.07,38.38 v33.02,38.33 | R17.2 R18.2 30,30.15 v30.04,30.19 | v29.21,26.9 29.21,27.05 C24.1 31.5,28.11 U13.5 | v54.61,29.44 54.61,28.04 C25.1 56.03,27.93 U14.5 | U11.5 49.83,41.8 C20.1 v48.57,43.01 | U15.5 54.47,40.05 C23.1 | TP_5V.1 79.15,78.32 5V.2
  Top 0.508: U25.3 145.29,18.81 C32.2 | C32.2 C31.2 | TP_5V.1 84.69,78.39 88.21,78.39 v88.26,78.33 | C13.1 52.38,36.92 v52.41,36.9 | C2.1 A2.3 128.47,30.51 129.96,29.02 U17.3 132.22,19.76 C9.1 | v54.42,38.81 54.42,40.04 C23.1 | C32.2 146.61,18.51 v146.61,17.58 | v57.15,62.46 54.08,59.39 U$2.4
  Bottom 0.508: J6.5 4.49,50.35 1.16,47.03 1.16,16.11 10.26,7.02 17.7,7.02 22.47,2.25 43.18,2.25 | 43.18,2.25 67.76,2.25 71.43,5.92 78.28,5.92 86.31,13.95 86.46,13.95 87.6,15.09 110.44,15.09 | v20.23,34.02 20.23,28.4 v20.97,27.66 21.64,26.99 28.04,26.99 29.18,25.85 | v30.09,35.06 29.4,34.36 29.4,30.83 v30.04,30.19 30.04,27.73 v29.21,26.9 29.21,25.85 29.18,25.85 | v33.02,38.33 34.29,37.06 34.29,36.33 v36.79,33.83 43.97,33.83 46.92,30.88 v47.65,30.88 v47.66,30.87 47.66,13.8 54.61,20.75 | v55.81,35.29 54.61,34.09 52.78,34.09 | 52.78,34.09 51.97,33.28 v51.97,31.34 52.6,30.71 53.34,30.71 v54.61,29.44 54.61,20.75 | 52.51,36.9 v54.42,38.81 50.23,43.01 v48.57,43.01 48.67,43.11 48.67,58.63 52.5,62.46 v57.15,62.46 67.31,62.46 83.18,78.33 v88.26,78.33 | 52.51,36.9 v52.41,36.9 | 52.78,34.09 52.51,34.36 52.51,36.9 | A2.3 128.47,26.39 124.84,22.76 118.11,22.76 110.44,15.09 | A1.VIN 175.58,20.87 169.8,15.09 145.82,15.09 | v146.61,17.58 146.61,15.88 145.82,15.09 | v63.79,30.97 63.79,29.91 54.61,20.73 | 54.61,20.75 54.61,20.73 | 110.44,15.09 145.82,15.09 | 43.18,2.25 44.53,3.6 44.53,10.5 | 44.53,10.5 29.18,25.85 | 44.53,10.5 44.53,10.65 54.61,20.73
+12V  (via drill 0.35, 0.76)
  Top 0.152: 12V.2 79.09,81.93 TP_12V.1 86.39,80.19 v86.79,80.19
  Top 0.508: 1.64,16.44 3.6,18.4 6.93,18.4 8.06,19.53 C8.1 8.21,20.08 U18.5 | J1.1 160.52,14.84 85.83,14.84 80.11,9.12 v80.01,9.12 76.88,9.12 69.44,1.67 31.96,1.67 26.59,7.04 8.48,7.04 1.64,13.88 1.64,16.44 | 1.64,16.44 1.64,32.77 | 1.64,32.77 1.64,54.21 3.78,56.35 J6.7 | J2.1 123.18,102.22 v91.44,102.22 | U1.4 97.49,83.33 99.72,85.55 99.72,88.93 | R56.2 99.72,88.93 | 1.64,32.77 2.52,33.64 v4.29,33.64 | A2.1 123.39,33.62 C1.1 121.32,35.66 F1.R2 F1.R1 | 99.72,88.93 99.72,92.21 98.04,93.89 97.55,93.89 U16.4 95.25,96.18 v95.25,98.02
  Bottom 0.254: U2.5 11.68,29.4 | 10.4,27.14 11.25,26.29 U2.1 U2.2 11.62,26.73 10.81,26.73
  Bottom 0.508: 7.44,33.64 10.11,33.64 C3.1 | U3.8 8.64,23.09 6.3,25.43 C6.1 C7.1 6.3,28.07 4.93,29.44 | 11.68,29.4 7.44,33.64 | R3.2 4.93,29.44 | 4.93,29.44 4.93,32.99 | 10.81,26.73 10.4,27.14 10.4,27.52 4.93,32.99 | 7.44,33.64 v4.29,33.64 4.93,32.99 | D8.1 133.79,29.06 133.79,30.11 128.82,35.09 126.51,35.09 A2.1 102.85,31.96 v80.01,9.12 | v95.25,98.02 95.25,98.25 91.44,102.06 v91.44,102.22 91.37,102.22 87.53,98.38 87.53,80.9 88.04,80.39 | J3.1 68.76,4.22 71.12,6.58 77.47,6.58 v80.01,9.12 | v80.01,9.12 72.39,16.74 72.39,56.11 89.36,73.08 89.36,79.07 88.04,80.39 | 88.04,80.39 87.83,80.19 v86.79,80.19
ACCUMULATOR_GND
  Top 0.508: J6.14 20.59,56.35 65.2,100.95 122.74,100.95 131.35,92.34 131.36,92.34 132.76,90.94 132.76,90.93 133.97,89.72 J2.7
AIR2-
  Top 0.152: Q1.3 47.54,71.31 29.58,53.35 J6.13
AMS_OK  (via drill 0.3)
  Top 0.152: v21.72,54.14 66.78,99.2 96.82,99.2 101.82,94.2 101.82,85.04 U1.3 97.49,78.75 R61.2 92.22,77.66 84.78,85.09 TP_AMS_OK.1 79.14,87 AMS_OK.2
  Bottom 0.152: J5.6 15.2,9.05 16.23,10.08 17.17,10.08 19.23,8.02 23.16,8.02 24.13,8.99 24.13,14.2 19.43,18.9 19.43,22.71 18.16,23.98 18.16,30.99 16.36,32.79 16.36,48.78 v21.72,54.14
AMS_OK_3.3V  (via drill 0.3)
  Top 0.152: R13.2 169.41,63.24 U6.1 168.7,64.69 v168.73,64.72 167.53,65.91 141.5,65.91 134.62,72.8 v134.62,81.51 130.83,85.3 123.9,85.3 | R21.1 120.67,85.3 | 120.67,85.3 123.9,85.3 | D13.3 123.9,85.3 | R54.1 120.67,85.3
BSPD_CURRENT  (via drill 0.3)
  Top 0.152: R11.2 6.78,22.12 U18.4 6.91,23.08 7.31,23.48 8.45,23.48 16.07,15.86 16.08,15.86 17.36,15.86 | v18.54,16.72 18.21,16.72 17.36,15.86 | 17.36,15.86 19.65,13.57 J5.10 | v18.61,20.94 15.44,24.12 15.44,24.63 11.94,28.13 11.94,34.11 44.58,66.75 92.23,66.75 104.14,54.84 104.14,47.78 BSPD_CURRENT.1 111.82,42.64 113.59,40.87 132.82,40.87 135.99,37.69 D9.1
  Bottom 0.152: v18.54,16.72 18.61,16.8 v18.61,20.94
BSPD_CURRENT_TEENSY
  Top 0.152: R45.1 R44.2 143.24,28.56 161.6,28.56 A1.D22
CANH
  Top 0.152: J6.3 4.08,42.99 4.08,36.64 8.33,32.4 8.33,28.89 22.63,14.59 22.63,12.07 J5.9 22.65,12.02 24.59,10.08 29.07,10.08 29.67,9.48 29.67,5.79 32.62,2.84 68.78,2.84 105.33,39.4 124.51,39.4 133.35,30.56 133.35,19.97 135.78,17.54 U25.7 138.89,16.88 138.9,16.88 140.45,15.32 156.55,15.32 160.62,19.4 J1.4
CANL
  Top 0.152: J6.2 5.3,41.36 4.39,40.45 4.39,36.77 8.63,32.52 8.63,29.06 J5.8 27.31,10.39 29.2,10.39 29.98,9.61 29.98,5.91 32.74,3.15 68.37,3.15 104.93,39.7 124.64,39.7 133.65,30.68 133.65,20.09 134.94,18.81 U25.6 138.89,18.15 138.9,18.15 141.4,15.65 153.85,15.65 160.17,21.97 162.59,21.97 J1.3
CHASSIS_GND  (via drill 0.76)
  Top 0.508: v2.86,39.76 2.86,53.41 4.09,54.64 20.81,54.64 65.86,99.68 122.75,99.68 128.47,93.96 128.47,90.15 129.31,89.31 J2.6
  Bottom 0.508: J5.11 14.12,14.59 4.64,14.59 2.86,16.37 v2.86,39.76
CS_LTC_6820
  Top 0.152: U5.5 158.71,59.96 160.27,58.4 160.27,57.63 156.95,54.31 RN1.5
CURRENT
  Top 0.152: U18.1 8.21,25.71 7.65,26.27 R9.2 7.63,26.55 7.63,32.67 3.75,36.54 3.75,44.11 5.03,45.39 5.88,45.39 6.48,44.78 6.48,40.33 J6.8 15.61,38.36 44.41,67.16 93.09,67.16 105.41,54.84 105.41,49.76 106.93,48.24 109.25,48.24 CURRENT_SENSE.1 111.1,48.26 113.15,46.21 R64.1
CURRENT_BUFFER
  Top 0.152: U26.2 124.25,45.45 U22.4 U22.3
CURRENT_FILTERED
  Top 0.152: A1.D21 159.94,29.44 141.42,29.44 136.3,34.56 136.3,37.82 131.58,42.54 U26.5
CURRENT_REF
  Top 0.152: R66.1 111.76,55.23 109.28,52.75 CURRENT_REF.1 94.04,67.54 44.32,67.54 18.14,41.36 J6.9
CURRENT_REF_BUFFER
  Top 0.152: U27.3 U27.4 124.25,54.6 U28.2
CURRENT_REF_FILTERED
  Top 0.152: U28.5 134.62,49.01 134.62,40.87 134.62,40.49 134.62,39.93 136.6,37.94 136.6,34.68 141.54,29.74 157.7,29.74 A1.D20
GND  (via drill 0.25, 0.3, 0.3 pad 0.55, 0.35, 0.76)
  Top 0.152: R10.1 3.7,21.66 v3.7,20.81 | U18.2 7.56,25.26 7.31,25.51 v4.12,25.51 | R9.1 v4.12,26.53 | C8.2 v4.64,19.92 | U26.3 125.04,44.18 v124.78,44.44 | C30.2 124.8,41.64 v126.05,41.64 | C28.2 123.26,48.1 v124.49,48.1 | U22.2 120.51,45.32 120.08,44.9 v120.08,44.82 | R65.2 117.02,44.74 v115.94,44.74 | C29.2 127.82,49.52 v128.85,49.52 | C45.2 130.13,48.5 v128.97,48.5 | v148.54,20.85 147.32,20.85 C31.1 | C32.1 v148.48,19.31 | C26.1 139.94,22.86 v139.95,22.87 | D4.1 69.03,68.87 v68.95,68.79 | R48.2 65.67,73.2 v65.68,73.21 | Q1.2 64.19,72.9 65.42,74.13 v65.75,74.13 | R36.2 v35.03,21.17 | C24.2 v27.69,28.11 | U13.2 32.19,25.95 32.19,24.99 v32.32,24.86 | U20.2 v70.97,25.34 | C37.2 71.45,28.02 v71.42,27.99 | U19.3 77.11,23.26 C40.2 74.31,23.26 v74.24,23.19 | C39.2 78.63,28.53 v79.73,28.53 | C43.2 80.14,28.02 v79.73,27.61 | C50.2 70.69,37.34 v70.66,37.36 | U29.2 71.41,34.42 v70.41,34.42 | C51.2 78.37,38.89 v79.5,38.89 | C53.2 80.91,37.97 v79.43,37.97 | C52.2 73.72,30.98 v73.71,30.96 | U30.3 76.59,33.78 v75.23,33.78 | R67.2 116.14,53.71 v116.13,53.72 | U27.2 121.22,54.42 v119.98,54.42 | C48.2 123.47,50.92 v123.44,50.9 | U28.3 126.13,53.57 v124.74,53.57 | C46.2 123.16,57.23 v124.21,57.23 | C49.2 130.15,57.53 v129.08,57.53 | C47.2 127.48,58.45 v129.08,58.45 | v174.42,60 173.23,60 C35.2 | U6.2 v168.05,63.67 v168.05,63.68 | R13.1 173.38,63.25 v174.6,63.25 | R52.2 142.79,78.72 v143.59,79.52 | R46.1 v140.11,81.48 v140.11,81.47 | R8.1 112.05,89.97 v112.05,88.92 | U16.2 106.33,94.42 v108.47,94.42 | Q2.2 110.88,87.26 v112.3,87.26 | R54.2 v117.95,79.73 v117.94,79.72 | D13.1 120.45,79.51 v120.47,79.49 | R15.2 92.05,93.88 v92.09,93.84 | R61.1 98.15,77.7 v99.29,77.7
  Top 0.152: C15.1 v149.13,62.34 | U5.8 146.27,63.13 v145.61,63.79 | U5.7 145.77,60.96 145.42,61.32 v145.42,62.52 | C14.2 143.55,62.89 v144.6,62.89 | R50.2 137.47,54.15 v137.46,54.14 | U5.14 140.93,58.96 v140.24,58.27 | U5.13 140.41,59.46 v139.26,58.31 | v75.16,104.67 C33.2 | D6.1 39.68,59.61 v39.37,59.92 | U$2.2 52.07,50.71 v52.07,48.49 | C20.2 47,41.86 v47,43.05 | C23.2 52.95,38.77 v52.93,38.75 | C13.2 49.66,36.99 48.48,36.99 v48.47,37 | R16.1 47.82,34.61 v47.81,34.6 | R40.1 v47.35,33.47 | R41.1 46.32,32.09 v47.31,32.09 | C11.2 v57.1,32.66 v57.11,32.66 | U10.2 59.26,31.93 v59.29,31.91 | R22.1 63.76,36.53 v63.69,36.6 | R25.1 62.18,36.51 v62.14,36.55 | R69.2 66.65,32.57 v66.41,32.57 | R63.2 67.19,24.59 v67.12,24.66 | R38.2 60.91,21.65 v60.91,21.63 | U7.2 v24.49,31.26 v24.49,31.25 | C22.2 23.47,29.1 v23.69,28.87 | R33.1 21.34,37.22 v21.34,38.23 | R32.1 23.9,37.16 v24.28,36.78 | R19.1 25.93,33.27 v25.91,33.24 | C16.2 30.54,32.24 v30.21,32.57 | U9.2 33.84,30.2 v33.82,30.18 | C27.2 38.23,31.39 v37.81,30.97 | C12.2 v33.2,36.88 v33.2,36.89 | C25.2 53,29.25 v52.98,29.27 | U14.2 56.81,25.6 v56.81,24.51 | U11.3 51.2,38.32 v51.19,38.31 | U4.2 53.37,31.83 v53.19,31.65 | U8.3 38.29,37.14 v38.73,37.14 | U12.2 40.36,31.56 v40.36,30.39 | U15.3 57.61,37.34 v58.07,37.34 | TP_GND.1 82.12,70.99 v82.07,71.04 | R72.1 v71.27,91.01 | R7.1 71.22,87.07 v71.2,87.05 | R62.1 97.86,86.92 v97.92,86.87 | C36.2 161.16,64.35 v161.14,64.36 | v166.85,64.42 166.76,64.51 R59.1 | R12.1 164.08,58.19 v165.3,58.19 | v138.2,24.79 138.24,24.83 R45.2 | D2.1 v21.59,25.1 | D3.1 11.21,17.41 v11.45,17.65 | U25.8 v136.79,16.27 v136.78,16.26 | U25.2 145.07,17.54 v145.08,17.55 | R1.1 71.17,78.41 v71.14,78.39
  Top 0.152: D10.1 v169.09,52.3 | D14.1 v169.14,50.72 | R77.1 50.82,22.68 v50.77,22.73 | R78.1 v38.18,26.09 | R55.1 32.03,15.01 v31.98,14.96 | R82.1 17.41,34.2 v17.4,34.21 | R79.1 v39.24,39.22 | R80.1 v56.16,43 | R81.1 v43.31,28.55 | v82.5,107.49 82.48,107.48 C34.2 | R87.1 29.32,36.32 v28.04,36.32 | R86.1 45.36,36.65 v45.39,36.63 | R85.1 v62.13,40.21 | R84.1 v64.64,38.3 | R2.1 v70.99,74.65 | R71.1 v71.25,82.02
  Top 0.508: C1.2 119.73,34.18 v119.32,33.77 | v132.38,29.08 131.02,30.45 C2.2 | v104.19,23.67 106.37,23.67 D1.1 | v131.29,16.13 132.38,17.22 C9.2 | C10.2 124.64,17.53 v124.59,17.48 | U17.1 124.98,19.38 v122.99,19.38
  Bottom 0.152: C4.2 v5.15,16.88 | v17.09,16.5 16.42,17.17 R60.1 | U3.1 14.8,23.8 v14.8,24.37 | U2.8 v17.09,27.29 | U2.4 10.88,27.79 10.31,28.36 v10.31,29.3 | C7.2 8.69,27.16 v9.09,27.16 | C6.2 v9.09,25.89 | C3.2 15.55,29.7 v15.69,29.7 | R43.2 v134.66,30.49 | R30.2 v135.58,44.24 | C5.2 4.43,17.55 v4.01,17.55
  other vias: 43.48,124.87 43.64,113.67 43.64,105.11 43.71,96.62 42.98,89.13 36.68,82.09 29.01,74.47 21.08,70.28 149.86,73.89 152.4,71.35 156.21,70.08 161.29,70.08 166.37,70.08 171.45,70.08 176.53,70.08 182.19,61.95 182.32,55.93 182.55,49.43 182.42,42.95 182.42,36.81 182.19,30.89 182.32,24.51
  pour GND: -24.13,148.82 -24.13,-6.12 196.85,-6.12 196.85,151.36 -24.13,151.36
  pour Top: 17.98,73.28 23.65,73.28 40.72,90.35 40.72,126.87 46.56,126.87 46.56,87.43 26.14,67.01 18.06,67.01 17.98,66.93
  pour Bottom: 40.39,126.87 46.53,126.87 46.56,126.85 46.56,87.43 26.14,67.01 17.98,67.01 17.98,73.28 23.62,73.28 40.69,90.35 40.69,126.57
  pour Top (isolate 0.305): 177.7,73.13 177.7,67.06 177.67,67.03 151.41,67.03 144.4,74.04 149.64,79.29 155.8,73.13
  pour Bottom (isolate 0.305): 149.63,79.27 155.78,73.13 177.7,73.13 177.7,67.03 151.41,67.03 144.4,74.04
  pour Top (isolate 0.305): 185.44,65.56 178.23,65.56 178.23,19.86 185.44,19.86
  pour Bottom (isolate 0.305): 185.44,65.56 185.44,19.84 178.23,19.84 178.23,65.56
HV+_OUT_OK
  Top 0.152: U8.4 43.12,38.3 | U11.1 48.67,38.3 43.18,38.3 43.12,38.3 | 43.12,38.3 R79.2
IM
  Top 0.152: TP7.1 78.9,128.29 T1.1 80.11,129.51 82.66,129.51 J4.2
IMD_OK  (via drill 0.3)
  Top 0.152: U16.3 97.47,91.37 93.27,95.57 D5.1 92.66,95.57 89.37,98.87 68.12,98.87 23.26,54 v23.21,54 | U16.3 85.07,91.37 TP_IMD_OK.1 79.16,90.96 IMD_OK.2 | R62.2 97.52,89.55 U16.3
  Bottom 0.152: J5.7 27.55,12.05 20.32,19.28 20.32,23.09 18.47,24.94 18.47,31.12 16.66,32.92 16.66,47.65 23.01,54 v23.21,54
IMD_OK_TEENSY  (via drill 0.3)
  Top 0.152: R14.2 88.77,93.91 R15.1 88.8,92.69 v88.75,92.63
  Bottom 0.152: v88.75,92.63 89.08,92.96 101.62,92.96 134.2,60.39 134.2,36.21 140.66,29.74 148.77,29.74 150.18,31.16 A1.D16
IP
  Top 0.152: T1.3 71.45,130.02 76.29,134.85 82.72,134.85 | 82.72,134.85 88.46,134.85 TP6.1 | J4.1 86.14,131.44 82.72,134.85
ISO_PACK+
  Top 0.152: R29.1 58.43,22.19 45.84,9.6 J3.5
ISO_PACK-
  Top 0.152: J3.6 42.94,7.21 55.15,19.42 R28.1 55,22.68 R77.2
ISO_TS+
  Top 0.152: J3.7 38.25,8.81 38.25,9.45 33.51,14.19 R27.1
ISO_TS-
  Top 0.152: R26.1 32.02,20.82 32.03,20.81 | 32.03,20.81 33.15,19.7 33.15,14.07 37.86,9.35 37.86,8.23 J3.8 | R55.2 32.03,20.81
MHS
  Top 0.152: J2.3 137.18,88.22 138.64,88.22 139.24,87.62 139.24,86.38 R46.2 143.62,82 D12.1
MHS_TEENSY  (via drill 0.3)
  Top 0.152: R51.2 141.54,77.52 R52.1 142.74,76.34 v142.74,76.18
  Bottom 0.152: v142.74,76.18 142.59,76.02 142.59,73.97 138.45,69.83 138.45,46.89 139.09,46.25 139.09,32.59 141.33,30.35 143.69,30.35 145.1,31.77 A1.D14
N$1
  Top 0.152: 3.3V.1 77.37,74.65 R2.2
N$2
  Top 0.152: 5V.1 R1.2
N$3
  Bottom 0.152: U3.6 7.17,20.31 7.04,20.18 6.9,20.03 C5.1 | R6.1 6.33,20.31 U3.6 | U3.2 11.31,21.58 10.65,20.91 10.64,20.91 10.03,20.31 U3.6
N$4
  Top 0.152: R31.1 42.18,59.55 D6.2
N$5
  Bottom 0.152: C4.1 8.64,17.71 U3.5
N$6
  Bottom 0.152: R3.1 R6.2 6.76,21.58 U3.7
N$7
  Top 0.152: R49.2 64.37,70.19 Q1.1
N$8
  Top 0.152: R34.2 106.4,91.95 U16.1
N$9
  Top 0.152: D11.1 R8.2
N$10
  Top 0.152: U13.1 31.56,24.72 32.2,24.08 R27.2 33.53,24.06 R36.1
N$11
  Top 0.152: U13.3 32.86,26.47 32.59,26.74 31.27,26.74 30.99,26.46 30.99,24.62 R26.2 28.94,24.08 R35.1
N$12
  Top 0.152: U18.3 6.28,23.82 R11.1 R10.2
N$13
  Top 0.152: U5.4 156.28,59.46 157.48,58.27 157.48,57.52 154.57,54.61 154.57,53.98 RN1.8
N$14
  Top 0.152: 12V.1 74.19,81.96 R71.2
N$15
  Top 0.152: U5.3 155.55,58.96 R70.1 156.61,57.89 153.57,54.84 153.57,53.52 153.85,53.23 155.16,53.23 155.35,53.42 RN1.7
N$16
  Top 0.152: R56.1 102.84,83.05 105.18,80.71 U1.1
N$17
  Top 0.152: AMS_OK.1 74.11,87.08 R7.2
N$18
  Top 0.152: RN1.6 156.15,53.26 155.8,52.91 153.09,52.91 147.53,58.46 U5.2
N$19
  Top 0.152: A1.D10 147.67,47.62 149.32,49.27 154.91,49.27 157,51.36 157,52.12 RN1.4
N$20
  Top 0.152: U1.2 Q2.3
N$21
  Top 0.152: A1.D11 147.06,49.58 154.76,49.58 156.15,50.97 RN1.3
N$22
  Top 0.152: R38.1 R29.2 57.89,23.78 56.65,23.78 56.12,24.31 56.12,25.64 U14.1
N$23
  Top 0.152: R37.1 52.26,24.38 54.93,24.38 55.15,24.6 | R28.2 55.15,24.6 | 55.15,24.6 55.15,26.07 55.74,26.66 56.93,26.66 57.37,26.21 U14.3
N$24
  Top 0.152: R73.2 21.56,22.24 D2.2
N$25
  Top 0.152: U25.4 144.82,21.45 144.82,21.51 147.97,24.66 168.96,24.66 171.63,27.33 171.63,38.87 A1.D4 163.49,47.62 164.48,48.61 170.91,48.61 171.9,47.62 A1.D0
N$26
  Top 0.152: C39.1 76.62,26.42 U19.1 79.36,25.86 81.59,23.62 82.08,23.62 U19.6
N$27
  Top 0.152: IMD_OK.1 77.36,91.01 R72.2
N$29
  Top 0.152: U25.1 144.07,16.89 145.36,16.89 145.74,17.28 145.74,17.82 145.36,18.21 144.12,18.21 144.11,18.2 142.77,18.2 142.64,18.33 142.64,19.28 142.77,19.42 144.06,19.42 145.12,20.48 145.12,21.38 145.26,21.52 146.35,21.52 146.48,21.38 146.48,20.44 146.76,20.16 148.75,20.16 152.94,24.36 169.09,24.36 171.98,27.26 171.98,41.06 | A1.D1 171.98,46.14 171.98,41.06 | A1.D3 171.98,41.06
N$30
  Top 0.152: Q2.1 113.13,85.37 R21.2
N$31
  Bottom 0.152: D7.2 136.46,46 R23.1
N$32
  Top 0.152: D5.2 91.6,95.51 R14.1
N$33
  Bottom 0.152: D8.2 135.72,29.04 R39.1
N$34
  Top 0.152: R44.1 138.77,26.48 136.88,24.59 D9.2
N$35  (via drill 0.35)
  Top 0.152: T1.10 71.45,108.87 R53.2 71.85,107.56 71.42,107.12 v71.42,106.74 | U5.11 v134.95,60.46
  Bottom 0.152: v134.95,60.46 134.56,60.46 91.33,103.69 74.51,103.69 71.47,106.74 v71.42,106.74
N$36
  Top 0.152: U5.16 139.37,55.27 R47.1
N$37
  Top 0.152: U5.15 141.4,58.46 139.9,56.97 R47.2 R50.1
N$38  (via drill 0.35)
  Top 0.152: U5.10 135.79,60.96 134.64,62.1 v134.14,62.1 | v81.25,108.64 79.08,108.64 | 79.08,108.64 R83.1 | 79.08,108.64 76.94,108.64 T1.12
  Bottom 0.152: v81.25,108.64 86.87,108.64 133.4,62.1 v134.14,62.1
N$39
  Top 0.152: C33.1 74.6,107.52 73.34,108.78 T1.11
N$40
  Top 0.152: D12.2 142.99,81.16 R51.1
N$41
  Top 0.152: U11.4 51.22,41.75 R57.1
N$42
  Top 0.152: R53.1 72.77,105.44 74.19,104.01 76.16,104.01 R83.2 78.19,105.98 C34.1
N$43
  Top 0.152: A1.D12 142.56,47.75 144.7,49.89 154.53,49.89 155.35,50.71 RN1.2
N$44
  Top 0.152: A1.D13 141.15,33.79 141.15,49.12 142.21,50.19 154.36,50.19 154.55,50.38 RN1.1
N$45
  Top 0.152: U19.8 82.38,27.33 C43.1
N$46
  Top 0.152: R74.2 D3.2
N$47
  Top 0.152: R75.1 D10.2
N$48
  Top 0.152: R63.1 R58.2 70.07,26 U20.1
N$49
  Top 0.152: R57.2 49.52,50.72 U$2.1
N$50
  Top 0.152: U26.6 128.92,44.18 127.04,46.06 127.03,46.06 U26.1 126.37,48.45 C29.1
N$51
  Top 0.152: C45.1 132.14,47.28 U26.8
N$52
  Top 0.152: R64.2 120.3,46.21 | U22.1 121.03,46.21 120.3,46.21 | R65.1 120.3,46.21
N$53
  Top 0.152: C47.1 126.37,57.72 U28.1 127.03,55.2 127.04,55.2 128.92,53.33 U28.6
N$54
  Top 0.152: C49.1 132.26,56.55 U28.8
N$55
  Top 0.152: R66.2 119.01,55.12 119.4,55.12 | 119.4,55.12 U27.1 | R67.1 118.9,54.63 119.4,55.12
N$56
  Top 0.152: C51.1 76.87,37.77 U30.1 78.23,36.04 80.77,33.5 U30.6
N$57
  Top 0.152: C53.1 82.08,37.64 U30.8
N$58
  Top 0.152: R69.1 R68.2 69.42,35.17 U29.1
N$59
  Top 0.152: R76.1 D14.2
OKHS
  Top 0.152: J2.2 133.97,90.41 135,89.38 135,86.76 134.4,86.16 131.78,86.16 123.45,94.49 D11.2 111.2,93.65 R34.1
PACK+_BUFFER
  Top 0.152: U29.3 U29.4 74.62,34.77 U30.2
PACK+_FILTERED  (via drill 0.25)
  Top 0.152: v85.09,31.98 82.33,31.98 U30.5
  Bottom 0.152: v85.09,31.98 93.98,31.98 103.02,41.02 128.83,41.02 140.41,29.44 151.31,29.44 152.72,30.85 A1.D17
PACK+_OUT
  Top 0.152: R42.2 42.86,30.23 48.26,30.23 | 48.26,30.23 52.48,30.23 | 52.48,30.23 52.73,30.23 | 55.03,30.23 U14.4 | U4.3 54.02,31.52 52.73,30.23 | 55.03,30.23 55.82,30.23 | U10.1 55.82,30.23 | R37.2 52.48,30.23 | 52.73,30.23 55.03,30.23 | 55.82,30.23 64.29,30.23 64.77,30.71 64.77,32.22 R68.1 67.7,37.93 PACK+_OUT_TEST.1 | 48.26,30.23 46.58,28.55 R81.2
PRECHARGE+_OUT_OK
  Top 0.152: U11.2 50.6,39.57 50.6,40.1 51.66,41.16 | 51.66,41.16 55.98,41.16 U15.4 | 51.66,41.16 53.2,42.71 R80.2
PRECHARGE_OK  (via drill 0.25, 0.3, 0.3 pad 0.55)
  Top 0.152: U$2.3 49.15,59.92 | 49.15,59.92 v49.15,63.62 | R31.2 46.1,59.92 49.15,59.92 | v136.39,68.92 82.73,68.92 79.42,72.24 D4.3 67.96,72.24 67.47,71.74 R48.1 R49.1 67.37,68.96 v67.51,68.81 | v49.99,21.66 41.38,13.04 41.38,5.44 40.16,4.22 J3.3
  Bottom 0.152: v136.39,68.92 136.46,68.92 D7.1 | v67.51,68.81 54.23,68.81 49.15,63.73 | 49.15,63.73 v49.15,63.62 | v49.99,21.66 49.99,37.61 47.78,39.83 47.78,62.35 49.15,63.73
PRECHARGE_OK_TEENSY
  Bottom 0.152: R23.2 138.41,44.26 R30.1 138.43,44.2 138.43,32.41 140.79,30.05 146.23,30.05 147.64,31.46 A1.D15
PRECHARGE_REACHED
  Top 0.152: U12.4 39.37,35.4 | 39.37,35.4 36.81,35.4 36.61,35.6 U8.2 | 39.37,35.4 40.62,36.65 R86.2
SHDN
  Bottom 0.508: 1.82,40.67 1.82,16.42 10.51,7.73 17.98,7.73 | J3.2 42.84,3.56 42.27,2.98 22.73,2.98 17.98,7.73 | J5.5 17.98,7.73 | 1.82,40.67 3.9,42.75 6.31,42.75 7.93,44.36 J6.10 | J6.12 6.95,48.85 4.56,48.85 1.82,46.12 1.82,40.67
TEENSY_OK
  Top 0.152: U6.3 167.33,62.61 165.03,62.61 R59.2 164.62,62.6 163.06,62.6 C36.1 162.25,61.78 162.25,56.37 160.04,54.16 160.04,49.86 A1.D6 157.8,47.21 158.79,46.22 161.18,46.22 161.69,46.73 161.69,49.36 R76.2
TIMER_EN
  Bottom 0.152: U3.4 14.02,18.87 R60.2 15.56,25.96 U2.10
TS+_OUT
  Top 0.152: U7.1 24.86,29 33.53,29 | 33.53,29 32.86,28.33 U13.4 31.85,27.15 | 33.53,29 37.11,29 U12.1 | 33.53,29 34.49,29.95 U9.3 | R35.2 28.22,23.09 28.22,24.63 30.74,27.15 31.85,27.15 | 31.85,27.15 36.44,27.15 | 64.47,27.15 36.83,27.15 36.44,27.15 | 64.47,27.15 67.22,27.15 R58.1 | TS+_OUT_TEST.1 64.47,27.15 | R78.2 36.44,27.15
TS+_OUT_BUFFER
  Top 0.152: U20.3 U20.4 77.07,24.7 U19.2
TS+_OUT_FILTERED  (via drill 0.25)
  Top 0.152: v85.09,21.82 82.61,21.82 U19.5
  Bottom 0.152: v85.09,21.82 103.95,40.68 128.69,40.68 140.25,29.11 153.92,29.11 155.26,30.45 A1.D18
TS+_OUT_OV_OK
  Top 0.152: U8.1 34.49,34.63 34.49,34.52 | 34.49,34.52 U9.4 | 34.49,34.52 32.66,36.35 R87.2
TSAL_GREEN  (via drill 0.25)
  Top 0.152: v17.2,24.36 17.62,23.94 R73.1 20.86,25.75 22.74,25.75 24.13,24.36 24.13,21.51 TP_TSAL_GREEN.1
  Bottom 0.152: U2.9 16.62,26.79 17.2,26.21 v17.2,24.36 17.2,17.32 17.78,16.74 17.78,13.31 18.1,12.99 18.1,12.06 20.65,9.51 22.19,9.51 J5.3
TSAL_RED  (via drill 0.25)
  Top 0.152: R74.1 13.45,16.72 v13.95,16.72 13.95,15.45 13.24,14.74 8.01,14.74 6.28,13.01 TP_TSAL_RED.1
  Bottom 0.152: J5.4 17.8,10.91 17.8,12.86 v13.95,16.72 13.05,17.61 13.05,19.51 13.18,19.64 13.19,19.64 U3.3
V_PACK_REF_OV_OK
  Top 0.152: U4.4 54.02,36.08 U15.1 55.79,38.6 56.24,39.04 57.95,39.04 R85.2
V_PACK_REF_UV_OK
  Top 0.152: U15.2 56.44,37.25 56.99,36.71 58.44,36.71 | U10.4 58.44,36.71 | 58.44,36.71 60.03,38.3 R84.2
WATCHDOG_INPUT
  Top 0.152: U6.4 166.99,59.93 165.35,59.93 | 165.35,59.93 R12.2 162.55,58.43 162.55,56.22 160.35,54.02 160.35,49.74 | A1.D5 160.34,49.73 160.35,49.74 | 160.35,49.74 162.91,52.3 R75.2 | 165.35,59.93 173.33,51.95 WATCHDOG_OK.1